# EAGLE design wordclock-2-r4 (EAGLE 5.12)
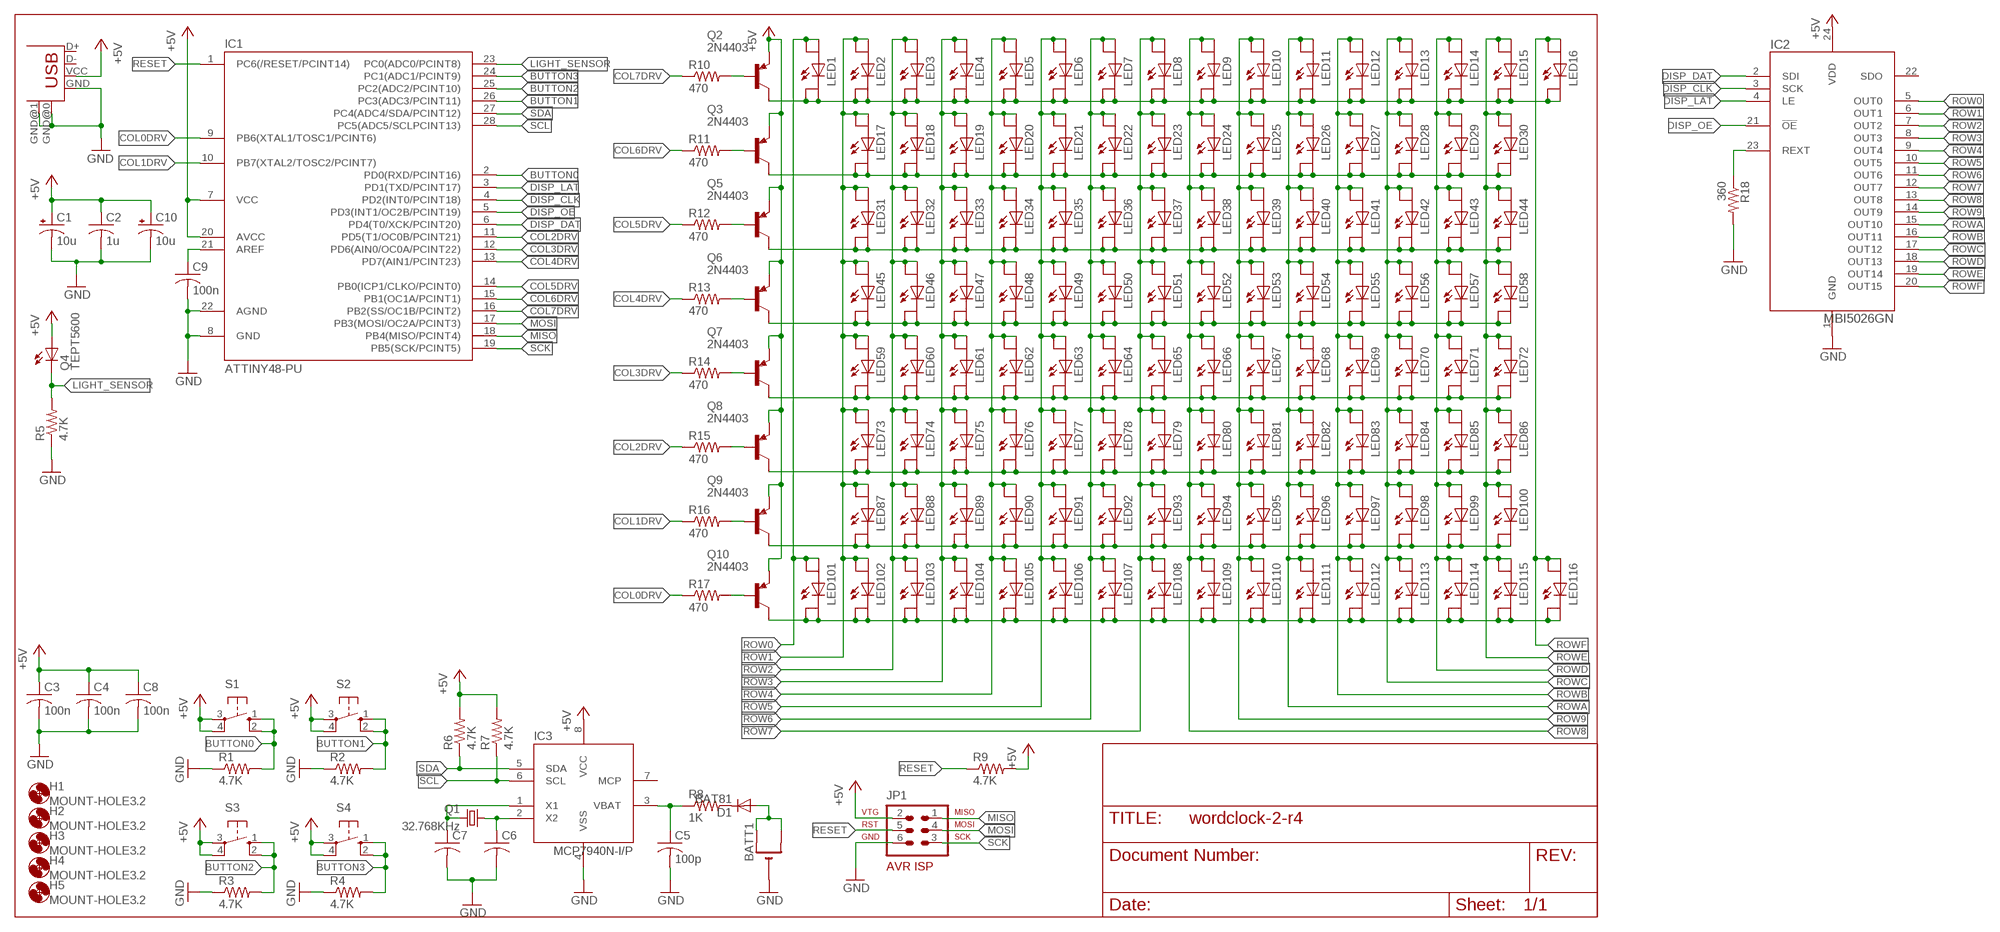
[diagram p0: schematic, sheet 1]

## Parts
BATT1  CR1220THM  [CR1220-THM]
C1  10u  CPOL-USE2-5  [E2-5]
C2  1u  C-US050-025X075  [C050-025X075]
C3  100n  C-US050-025X075  [C050-025X075]
C4  100n  C-US050-025X075  [C050-025X075]
C5  100p  C-US050-025X075  [C050-025X075]
C6  C-US025-025X050  [C025-025X050]
C7  C-US025-025X050  [C025-025X050]
C8  100n  C-US050-025X075  [C050-025X075]
C9  100n  C-US050-025X075  [C050-025X075]
C10  10u  CPOL-USE2-5  [E2-5]
D1  BAT81  [DO34-7]
H1  MOUNT-HOLE3.2  [3,2]
H2  MOUNT-HOLE3.2  [3,2]
H3  MOUNT-HOLE3.2  [3,2]
H4  MOUNT-HOLE3.2  [3,2]
H5  MOUNT-HOLE3.2  [3,2]
IC1  ATTINY48-PU  MEGA48/88/168-PU  [DIL28-3]
IC2  MBI5026GN  [DIP-24]
IC3  MCP7940N-I/P  [DIP-8]
JP1  AVR-ISP-6  [AVR-ISP-6]
LED1  LED-2PLCC2-T1.75  [PLCC2-T1.75]
LED2  LED-2PLCC2-T1.75  [PLCC2-T1.75]
LED3  LED-2PLCC2-T1.75  [PLCC2-T1.75]
LED4  LED-2PLCC2-T1.75  [PLCC2-T1.75]
LED5  LED-2PLCC2-T1.75  [PLCC2-T1.75]
LED6  LED-2PLCC2-T1.75  [PLCC2-T1.75]
LED7  LED-2PLCC2-T1.75  [PLCC2-T1.75]
LED8  LED-2PLCC2-T1.75  [PLCC2-T1.75]
LED9  LED-2PLCC2-T1.75  [PLCC2-T1.75]
LED10  LED-2PLCC2-T1.75  [PLCC2-T1.75]
LED11  LED-2PLCC2-T1.75  [PLCC2-T1.75]
LED12  LED-2PLCC2-T1.75  [PLCC2-T1.75]
LED13  LED-2PLCC2-T1.75  [PLCC2-T1.75]
LED14  LED-2PLCC2-T1.75  [PLCC2-T1.75]
LED15  LED-2PLCC2-T1.75  [PLCC2-T1.75]
LED16  LED-2PLCC2-T1.75  [PLCC2-T1.75]
LED17  LED-2PLCC2-T1.75  [PLCC2-T1.75]
LED18  LED-2PLCC2-T1.75  [PLCC2-T1.75]
LED19  LED-2PLCC2-T1.75  [PLCC2-T1.75]
LED20  LED-2PLCC2-T1.75  [PLCC2-T1.75]
LED21  LED-2PLCC2-T1.75  [PLCC2-T1.75]
LED22  LED-2PLCC2-T1.75  [PLCC2-T1.75]
LED23  LED-2PLCC2-T1.75  [PLCC2-T1.75]
LED24  LED-2PLCC2-T1.75  [PLCC2-T1.75]
LED25  LED-2PLCC2-T1.75  [PLCC2-T1.75]
LED26  LED-2PLCC2-T1.75  [PLCC2-T1.75]
LED27  LED-2PLCC2-T1.75  [PLCC2-T1.75]
LED28  LED-2PLCC2-T1.75  [PLCC2-T1.75]
LED29  LED-2PLCC2-T1.75  [PLCC2-T1.75]
LED30  LED-2PLCC2-T1.75  [PLCC2-T1.75]
LED31  LED-2PLCC2-T1.75  [PLCC2-T1.75]
LED32  LED-2PLCC2-T1.75  [PLCC2-T1.75]
LED33  LED-2PLCC2-T1.75  [PLCC2-T1.75]
LED34  LED-2PLCC2-T1.75  [PLCC2-T1.75]
LED35  LED-2PLCC2-T1.75  [PLCC2-T1.75]
LED36  LED-2PLCC2-T1.75  [PLCC2-T1.75]
LED37  LED-2PLCC2-T1.75  [PLCC2-T1.75]
LED38  LED-2PLCC2-T1.75  [PLCC2-T1.75]
LED39  LED-2PLCC2-T1.75  [PLCC2-T1.75]
LED40  LED-2PLCC2-T1.75  [PLCC2-T1.75]
LED41  LED-2PLCC2-T1.75  [PLCC2-T1.75]
LED42  LED-2PLCC2-T1.75  [PLCC2-T1.75]
LED43  LED-2PLCC2-T1.75  [PLCC2-T1.75]
LED44  LED-2PLCC2-T1.75  [PLCC2-T1.75]
LED45  LED-2PLCC2-T1.75  [PLCC2-T1.75]
LED46  LED-2PLCC2-T1.75  [PLCC2-T1.75]
LED47  LED-2PLCC2-T1.75  [PLCC2-T1.75]
LED48  LED-2PLCC2-T1.75  [PLCC2-T1.75]
LED49  LED-2PLCC2-T1.75  [PLCC2-T1.75]
LED50  LED-2PLCC2-T1.75  [PLCC2-T1.75]
LED51  LED-2PLCC2-T1.75  [PLCC2-T1.75]
LED52  LED-2PLCC2-T1.75  [PLCC2-T1.75]
LED53  LED-2PLCC2-T1.75  [PLCC2-T1.75]
LED54  LED-2PLCC2-T1.75  [PLCC2-T1.75]
LED55  LED-2PLCC2-T1.75  [PLCC2-T1.75]
LED56  LED-2PLCC2-T1.75  [PLCC2-T1.75]
LED57  LED-2PLCC2-T1.75  [PLCC2-T1.75]
LED58  LED-2PLCC2-T1.75  [PLCC2-T1.75]
LED59  LED-2PLCC2-T1.75  [PLCC2-T1.75]
LED60  LED-2PLCC2-T1.75  [PLCC2-T1.75]
LED61  LED-2PLCC2-T1.75  [PLCC2-T1.75]
LED62  LED-2PLCC2-T1.75  [PLCC2-T1.75]
LED63  LED-2PLCC2-T1.75  [PLCC2-T1.75]
LED64  LED-2PLCC2-T1.75  [PLCC2-T1.75]
LED65  LED-2PLCC2-T1.75  [PLCC2-T1.75]
LED66  LED-2PLCC2-T1.75  [PLCC2-T1.75]
LED67  LED-2PLCC2-T1.75  [PLCC2-T1.75]
LED68  LED-2PLCC2-T1.75  [PLCC2-T1.75]
LED69  LED-2PLCC2-T1.75  [PLCC2-T1.75]
LED70  LED-2PLCC2-T1.75  [PLCC2-T1.75]
LED71  LED-2PLCC2-T1.75  [PLCC2-T1.75]
LED72  LED-2PLCC2-T1.75  [PLCC2-T1.75]
LED73  LED-2PLCC2-T1.75  [PLCC2-T1.75]
LED74  LED-2PLCC2-T1.75  [PLCC2-T1.75]
LED75  LED-2PLCC2-T1.75  [PLCC2-T1.75]
LED76  LED-2PLCC2-T1.75  [PLCC2-T1.75]
LED77  LED-2PLCC2-T1.75  [PLCC2-T1.75]
LED78  LED-2PLCC2-T1.75  [PLCC2-T1.75]
LED79  LED-2PLCC2-T1.75  [PLCC2-T1.75]
LED80  LED-2PLCC2-T1.75  [PLCC2-T1.75]
LED81  LED-2PLCC2-T1.75  [PLCC2-T1.75]
LED82  LED-2PLCC2-T1.75  [PLCC2-T1.75]
LED83  LED-2PLCC2-T1.75  [PLCC2-T1.75]
LED84  LED-2PLCC2-T1.75  [PLCC2-T1.75]
LED85  LED-2PLCC2-T1.75  [PLCC2-T1.75]
LED86  LED-2PLCC2-T1.75  [PLCC2-T1.75]
LED87  LED-2PLCC2-T1.75  [PLCC2-T1.75]
LED88  LED-2PLCC2-T1.75  [PLCC2-T1.75]
LED89  LED-2PLCC2-T1.75  [PLCC2-T1.75]
LED90  LED-2PLCC2-T1.75  [PLCC2-T1.75]
LED91  LED-2PLCC2-T1.75  [PLCC2-T1.75]
LED92  LED-2PLCC2-T1.75  [PLCC2-T1.75]
LED93  LED-2PLCC2-T1.75  [PLCC2-T1.75]
LED94  LED-2PLCC2-T1.75  [PLCC2-T1.75]
LED95  LED-2PLCC2-T1.75  [PLCC2-T1.75]
LED96  LED-2PLCC2-T1.75  [PLCC2-T1.75]
LED97  LED-2PLCC2-T1.75  [PLCC2-T1.75]
LED98  LED-2PLCC2-T1.75  [PLCC2-T1.75]
LED99  LED-2PLCC2-T1.75  [PLCC2-T1.75]
LED100  LED-2PLCC2-T1.75  [PLCC2-T1.75]
LED101  LED-2PLCC2-T1.75  [PLCC2-T1.75]
LED102  LED-2PLCC2-T1.75  [PLCC2-T1.75]
LED103  LED-2PLCC2-T1.75  [PLCC2-T1.75]
LED104  LED-2PLCC2-T1.75  [PLCC2-T1.75]
LED105  LED-2PLCC2-T1.75  [PLCC2-T1.75]
LED106  LED-2PLCC2-T1.75  [PLCC2-T1.75]
LED107  LED-2PLCC2-T1.75  [PLCC2-T1.75]
LED108  LED-2PLCC2-T1.75  [PLCC2-T1.75]
LED109  LED-2PLCC2-T1.75  [PLCC2-T1.75]
LED110  LED-2PLCC2-T1.75  [PLCC2-T1.75]
LED111  LED-2PLCC2-T1.75  [PLCC2-T1.75]
LED112  LED-2PLCC2-T1.75  [PLCC2-T1.75]
LED113  LED-2PLCC2-T1.75  [PLCC2-T1.75]
LED114  LED-2PLCC2-T1.75  [PLCC2-T1.75]
LED115  LED-2PLCC2-T1.75  [PLCC2-T1.75]
LED116  LED-2PLCC2-T1.75  [PLCC2-T1.75]
Q1  32.768KHz  CRYSTALTC38H  [TC38H]
Q2  2N4403  2N3906  [TO92]
Q3  2N4403  2N3906  [TO92]
Q4  TEPT5600  LED5MM  [LED5MM]
Q5  2N4403  2N3906  [TO92]
Q6  2N4403  2N3906  [TO92]
Q7  2N4403  2N3906  [TO92]
Q8  2N4403  2N3906  [TO92]
Q9  2N4403  2N3906  [TO92]
Q10  2N4403  2N3906  [TO92]
R1  4.7K  R-US_0207/10  [0207/10]
R2  4.7K  R-US_0207/10  [0207/10]
R3  4.7K  R-US_0207/10  [0207/10]
R4  4.7K  R-US_0207/10  [0207/10]
R5  4.7K  R-US_0207/10  [0207/10]
R6  4.7K  R-US_0207/10  [0207/10]
R7  4.7K  R-US_0207/10  [0207/10]
R8  1K  R-US_0207/10  [0207/10]
R9  4.7K  R-US_0207/10  [0207/10]
R10  470  R-US_0207/10  [0207/10]
R11  470  R-US_0207/10  [0207/10]
R12  470  R-US_0207/10  [0207/10]
R13  470  R-US_0207/10  [0207/10]
R14  470  R-US_0207/10  [0207/10]
R15  470  R-US_0207/10  [0207/10]
R16  470  R-US_0207/10  [0207/10]
R17  470  R-US_0207/10  [0207/10]
R18  360  R-US_0207/10  [0207/10]
S1  10-XX  [B3F-10XX]
S2  10-XX  [B3F-10XX]
S3  10-XX  [B3F-10XX]
S4  10-XX  [B3F-10XX]
USB1  USB-U  [USB-MICROB-ALI]

## Nets
+5V: C1.+ C2.1 C3.1 C4.1 C8.1 C10.+ IC1.7(VCC) IC1.20(AVCC) IC2.24(VDD) IC3.8(VCC) JP1.2 Q2.3(E) Q3.3(E) Q4.A Q5.3(E) Q6.3(E) Q7.3(E) Q8.3(E) Q9.3(E) Q10.3(E) R6.2 R7.2 R9.2 S1.3(P) S1.4(P1) S2.3(P) S2.4(P1) S3.3(P) S3.4(P1) S4.3(P) S4.4(P1) USB1.VCC(VBUS)
BUTTON0: IC1.2(PD0(RXD/PCINT16)) R1.2 S1.1(S) S1.2(S1)
BUTTON1: IC1.26(PC3(ADC3/PCINT11)) R2.2 S2.1(S) S2.2(S1)
BUTTON2: IC1.25(PC2(ADC2/PCINT10)) R3.2 S3.1(S) S3.2(S1)
BUTTON3: IC1.24(PC1(ADC1/PCINT9)) R4.2 S4.1(S) S4.2(S1)
COL0: LED101.K1(K) LED101.K2(K1) LED102.K1(K) LED102.K2(K1) LED103.K1(K) LED103.K2(K1) LED104.K1(K) LED104.K2(K1) LED105.K1(K) LED105.K2(K1) LED106.K1(K) LED106.K2(K1) LED107.K1(K) LED107.K2(K1) LED108.K1(K) LED108.K2(K1) LED109.K1(K) LED109.K2(K1) LED110.K1(K) LED110.K2(K1) LED111.K1(K) LED111.K2(K1) LED112.K1(K) LED112.K2(K1) LED113.K1(K) LED113.K2(K1) LED114.K1(K) LED114.K2(K1) LED115.K1(K) LED115.K2(K1) LED116.K1(K) LED116.K2(K1) Q10.1(C)
COL0DRV: IC1.9(PB6(XTAL1/TOSC1/PCINT6)) R17.1
COL1: LED87.K1(K) LED87.K2(K1) LED88.K1(K) LED88.K2(K1) LED89.K1(K) LED89.K2(K1) LED90.K1(K) LED90.K2(K1) LED91.K1(K) LED91.K2(K1) LED92.K1(K) LED92.K2(K1) LED93.K1(K) LED93.K2(K1) LED94.K1(K) LED94.K2(K1) LED95.K1(K) LED95.K2(K1) LED96.K1(K) LED96.K2(K1) LED97.K1(K) LED97.K2(K1) LED98.K1(K) LED98.K2(K1) LED99.K1(K) LED99.K2(K1) LED100.K1(K) LED100.K2(K1) Q9.1(C)
COL1DRV: IC1.10(PB7(XTAL2/TOSC2/PCINT7)) R16.1
COL2: LED73.K1(K) LED73.K2(K1) LED74.K1(K) LED74.K2(K1) LED75.K1(K) LED75.K2(K1) LED76.K1(K) LED76.K2(K1) LED77.K1(K) LED77.K2(K1) LED78.K1(K) LED78.K2(K1) LED79.K1(K) LED79.K2(K1) LED80.K1(K) LED80.K2(K1) LED81.K1(K) LED81.K2(K1) LED82.K1(K) LED82.K2(K1) LED83.K1(K) LED83.K2(K1) LED84.K1(K) LED84.K2(K1) LED85.K1(K) LED85.K2(K1) LED86.K1(K) LED86.K2(K1) Q8.1(C)
COL2DRV: IC1.11(PD5(T1/OC0B/PCINT21)) R15.1
COL3: LED59.K1(K) LED59.K2(K1) LED60.K1(K) LED60.K2(K1) LED61.K1(K) LED61.K2(K1) LED62.K1(K) LED62.K2(K1) LED63.K1(K) LED63.K2(K1) LED64.K1(K) LED64.K2(K1) LED65.K1(K) LED65.K2(K1) LED66.K1(K) LED66.K2(K1) LED67.K1(K) LED67.K2(K1) LED68.K1(K) LED68.K2(K1) LED69.K1(K) LED69.K2(K1) LED70.K1(K) LED70.K2(K1) LED71.K1(K) LED71.K2(K1) LED72.K1(K) LED72.K2(K1) Q7.1(C)
COL3DRV: IC1.12(PD6(AIN0/OC0A/PCINT22)) R14.1
COL4: LED45.K1(K) LED45.K2(K1) LED46.K1(K) LED46.K2(K1) LED47.K1(K) LED47.K2(K1) LED48.K1(K) LED48.K2(K1) LED49.K1(K) LED49.K2(K1) LED50.K1(K) LED50.K2(K1) LED51.K1(K) LED51.K2(K1) LED52.K1(K) LED52.K2(K1) LED53.K1(K) LED53.K2(K1) LED54.K1(K) LED54.K2(K1) LED55.K1(K) LED55.K2(K1) LED56.K1(K) LED56.K2(K1) LED57.K1(K) LED57.K2(K1) LED58.K1(K) LED58.K2(K1) Q6.1(C)
COL4DRV: IC1.13(PD7(AIN1/PCINT23)) R13.1
COL5: LED31.K1(K) LED31.K2(K1) LED32.K1(K) LED32.K2(K1) LED33.K1(K) LED33.K2(K1) LED34.K1(K) LED34.K2(K1) LED35.K1(K) LED35.K2(K1) LED36.K1(K) LED36.K2(K1) LED37.K1(K) LED37.K2(K1) LED38.K1(K) LED38.K2(K1) LED39.K1(K) LED39.K2(K1) LED40.K1(K) LED40.K2(K1) LED41.K1(K) LED41.K2(K1) LED42.K1(K) LED42.K2(K1) LED43.K1(K) LED43.K2(K1) LED44.K1(K) LED44.K2(K1) Q5.1(C)
COL5DRV: IC1.14(PB0(ICP1/CLKO/PCINT0)) R12.1
COL6: LED17.K1(K) LED17.K2(K1) LED18.K1(K) LED18.K2(K1) LED19.K1(K) LED19.K2(K1) LED20.K1(K) LED20.K2(K1) LED21.K1(K) LED21.K2(K1) LED22.K1(K) LED22.K2(K1) LED23.K1(K) LED23.K2(K1) LED24.K1(K) LED24.K2(K1) LED25.K1(K) LED25.K2(K1) LED26.K1(K) LED26.K2(K1) LED27.K1(K) LED27.K2(K1) LED28.K1(K) LED28.K2(K1) LED29.K1(K) LED29.K2(K1) LED30.K1(K) LED30.K2(K1) Q3.1(C)
COL6DRV: IC1.15(PB1(OC1A/PCINT1)) R11.1
COL7: LED1.K1(K) LED1.K2(K1) LED2.K1(K) LED2.K2(K1) LED3.K1(K) LED3.K2(K1) LED4.K1(K) LED4.K2(K1) LED5.K1(K) LED5.K2(K1) LED6.K1(K) LED6.K2(K1) LED7.K1(K) LED7.K2(K1) LED8.K1(K) LED8.K2(K1) LED9.K1(K) LED9.K2(K1) LED10.K1(K) LED10.K2(K1) LED11.K1(K) LED11.K2(K1) LED12.K1(K) LED12.K2(K1) LED13.K1(K) LED13.K2(K1) LED14.K1(K) LED14.K2(K1) LED15.K1(K) LED15.K2(K1) LED16.K1(K) LED16.K2(K1) Q2.1(C)
COL7DRV: IC1.16(PB2(SS/OC1B/PCINT2)) R10.1
DISP_CLK: IC1.4(PD2(INT0/PCINT18)) IC2.3(SCK)
DISP_DAT: IC1.6(PD4(T0/XCK/PCINT20)) IC2.2(SDI)
DISP_LAT: IC1.3(PD1(TXD/PCINT17)) IC2.4(LE)
DISP_OE: IC1.5(PD3(INT1/OC2B/PCINT19)) IC2.21(!OE)
GND: BATT1.- C1.- C2.2 C3.2 C4.2 C5.2 C6.2 C7.2 C8.2 C9.2 C10.- IC1.8(GND) IC1.22(AGND) IC2.1(GND) IC3.4(VSS) JP1.6 R1.1 R2.1 R3.1 R4.1 R5.1 R18.2 USB1.GND USB1.GND@0(GND) USB1.GND@1(GND)
LIGHT_SENSOR: IC1.23(PC0(ADC0/PCINT8)) Q4.K(C) R5.2
MISO: IC1.18(PB4(MISO/PCINT4)) JP1.1
MOSI: IC1.17(PB3(MOSI/OC2A/PCINT3)) JP1.4
N$1: C7.1 IC3.1(X1) Q1.2
N$2: C6.1 IC3.2(X2) Q1.1
N$3: D1.C R8.2
N$4: BATT1.+1(+) BATT1.+2(+1) D1.A
N$5: Q2.2(B) R10.2
N$6: C5.1 IC3.3(VBAT) R8.1
N$7: Q3.2(B) R11.2
N$8: Q5.2(B) R12.2
N$9: Q6.2(B) R13.2
N$10: Q7.2(B) R14.2
N$11: Q8.2(B) R15.2
N$12: Q9.2(B) R16.2
N$13: Q10.2(B) R17.2
N$14: C9.1 IC1.21(AREF)
N$15: IC2.23(REXT) R18.1
RESET: IC1.1(PC6(/RESET/PCINT14)) JP1.5 R9.1
ROW0: IC2.5(OUT0) LED1.A1(A) LED1.A2(A1) LED101.A1(A) LED101.A2(A1)
ROW1: IC2.6(OUT1) LED2.A1(A) LED2.A2(A1) LED17.A1(A) LED17.A2(A1) LED31.A1(A) LED31.A2(A1) LED45.A1(A) LED45.A2(A1) LED59.A1(A) LED59.A2(A1) LED73.A1(A) LED73.A2(A1) LED87.A1(A) LED87.A2(A1) LED102.A1(A) LED102.A2(A1)
ROW2: IC2.7(OUT2) LED3.A1(A) LED3.A2(A1) LED18.A1(A) LED18.A2(A1) LED32.A1(A) LED32.A2(A1) LED46.A1(A) LED46.A2(A1) LED60.A1(A) LED60.A2(A1) LED74.A1(A) LED74.A2(A1) LED88.A1(A) LED88.A2(A1) LED103.A1(A) LED103.A2(A1)
ROW3: IC2.8(OUT3) LED4.A1(A) LED4.A2(A1) LED19.A1(A) LED19.A2(A1) LED33.A1(A) LED33.A2(A1) LED47.A1(A) LED47.A2(A1) LED61.A1(A) LED61.A2(A1) LED75.A1(A) LED75.A2(A1) LED89.A1(A) LED89.A2(A1) LED104.A1(A) LED104.A2(A1)
ROW4: IC2.9(OUT4) LED5.A1(A) LED5.A2(A1) LED20.A1(A) LED20.A2(A1) LED34.A1(A) LED34.A2(A1) LED48.A1(A) LED48.A2(A1) LED62.A1(A) LED62.A2(A1) LED76.A1(A) LED76.A2(A1) LED90.A1(A) LED90.A2(A1) LED105.A1(A) LED105.A2(A1)
ROW5: IC2.10(OUT5) LED6.A1(A) LED6.A2(A1) LED21.A1(A) LED21.A2(A1) LED35.A1(A) LED35.A2(A1) LED49.A1(A) LED49.A2(A1) LED63.A1(A) LED63.A2(A1) LED77.A1(A) LED77.A2(A1) LED91.A1(A) LED91.A2(A1) LED106.A1(A) LED106.A2(A1)
ROW6: IC2.11(OUT6) LED7.A1(A) LED7.A2(A1) LED22.A1(A) LED22.A2(A1) LED36.A1(A) LED36.A2(A1) LED50.A1(A) LED50.A2(A1) LED64.A1(A) LED64.A2(A1) LED78.A1(A) LED78.A2(A1) LED92.A1(A) LED92.A2(A1) LED107.A1(A) LED107.A2(A1)
ROW7: IC2.12(OUT7) LED8.A1(A) LED8.A2(A1) LED23.A1(A) LED23.A2(A1) LED37.A1(A) LED37.A2(A1) LED51.A1(A) LED51.A2(A1) LED65.A1(A) LED65.A2(A1) LED79.A1(A) LED79.A2(A1) LED93.A1(A) LED93.A2(A1) LED108.A1(A) LED108.A2(A1)
ROW8: IC2.13(OUT8) LED9.A1(A) LED9.A2(A1) LED24.A1(A) LED24.A2(A1) LED38.A1(A) LED38.A2(A1) LED52.A1(A) LED52.A2(A1) LED66.A1(A) LED66.A2(A1) LED80.A1(A) LED80.A2(A1) LED94.A1(A) LED94.A2(A1) LED109.A1(A) LED109.A2(A1)
ROW9: IC2.14(OUT9) LED10.A1(A) LED10.A2(A1) LED25.A1(A) LED25.A2(A1) LED39.A1(A) LED39.A2(A1) LED53.A1(A) LED53.A2(A1) LED67.A1(A) LED67.A2(A1) LED81.A1(A) LED81.A2(A1) LED95.A1(A) LED95.A2(A1) LED110.A1(A) LED110.A2(A1)
ROWA: IC2.15(OUT10) LED11.A1(A) LED11.A2(A1) LED26.A1(A) LED26.A2(A1) LED40.A1(A) LED40.A2(A1) LED54.A1(A) LED54.A2(A1) LED68.A1(A) LED68.A2(A1) LED82.A1(A) LED82.A2(A1) LED96.A1(A) LED96.A2(A1) LED111.A1(A) LED111.A2(A1)
ROWB: IC2.16(OUT11) LED12.A1(A) LED12.A2(A1) LED27.A1(A) LED27.A2(A1) LED41.A1(A) LED41.A2(A1) LED55.A1(A) LED55.A2(A1) LED69.A1(A) LED69.A2(A1) LED83.A1(A) LED83.A2(A1) LED97.A1(A) LED97.A2(A1) LED112.A1(A) LED112.A2(A1)
ROWC: IC2.17(OUT12) LED13.A1(A) LED13.A2(A1) LED28.A1(A) LED28.A2(A1) LED42.A1(A) LED42.A2(A1) LED56.A1(A) LED56.A2(A1) LED70.A1(A) LED70.A2(A1) LED84.A1(A) LED84.A2(A1) LED98.A1(A) LED98.A2(A1) LED113.A1(A) LED113.A2(A1)
ROWD: IC2.18(OUT13) LED14.A1(A) LED14.A2(A1) LED29.A1(A) LED29.A2(A1) LED43.A1(A) LED43.A2(A1) LED57.A1(A) LED57.A2(A1) LED71.A1(A) LED71.A2(A1) LED85.A1(A) LED85.A2(A1) LED99.A1(A) LED99.A2(A1) LED114.A1(A) LED114.A2(A1)
ROWE: IC2.19(OUT14) LED15.A1(A) LED15.A2(A1) LED30.A1(A) LED30.A2(A1) LED44.A1(A) LED44.A2(A1) LED58.A1(A) LED58.A2(A1) LED72.A1(A) LED72.A2(A1) LED86.A1(A) LED86.A2(A1) LED100.A1(A) LED100.A2(A1) LED115.A1(A) LED115.A2(A1)
ROWF: IC2.20(OUT15) LED16.A1(A) LED16.A2(A1) LED116.A1(A) LED116.A2(A1)
SCK: IC1.19(PB5(SCK/PCINT5)) JP1.3
SCL: IC1.28(PC5(ADC5/SCLPCINT13)) IC3.6(SCL) R7.1
SDA: IC1.27(PC4(ADC4/SDA/PCINT12)) IC3.5(SDA) R6.1
Unconnected: IC2.22(SDO) IC3.7(MCP) USB1.D+ USB1.D-

## Library data of the parts
BATT1 = adafruit:CR1220: CR1216/CR1220/CR1225 12mm 3V lithium coin cell Great for battery packup. Both SMT and THM holders. Note the THM package has the ground pads on both sides of the PCB so that the masks are the same - this reduces the cost
C1 C10 = rcl:CPOL-US: POLARIZED CAPACITOR, American symbol
C2-C9 = rcl:C-US: CAPACITOR, American symbol
D1 = diode:BAT81: DIODE barrier diode
H1-H5 = holes:MOUNT-HOLE: MOUNTING HOLE with drill center marker
IC1 = avr-5-4.16:MEGA48/88/168-PU
IC2 = rbg-macroblock-led-driver:MBI5026
IC3 = rbg-microchip-rtc:MCP7940N
JP1 = avr-5:AVR-ISP-6: AVR ISP-6 Serial Programming Header
LED1-LED116 = rbg-comboled:LED-2
Q1 = crystal:CRYSTAL: CRYSTAL; OC_FARNELL: unknown; OC_NEWARK: unknown
Q2 Q3 Q5-Q10 = transistor-pnp:2N3906: PNP Transistor
Q4 = led:LED: LED OSRAM: - CHIPLED LG R971, LG N971, LY N971, LG Q971, LY Q971, LO R971, LY R971 LH N974, LH R974 LS Q976, LO Q976, LY Q976 LO Q996 - Hyper CHIPLED LW Q18S LB Q993, LB Q99A, LB R99A - SideLED LS A670, LO A670, LY A670, LG A670, LP A670 LB A673, LV A673, LT A673, LW A673 LH A674 LY A675 LS A676, LA A676, LO A676, LY A676, LW A676 LS A679, LY A679, LG A679 - Hyper Micro SIDELED® LS Y876, LA Y876, LO Y876, LY Y876 LT Y87S - SmartLED LW L88C, LW L88S LB L89C, LB L89S, LG L890 LS L89K, LO L89K, LY L89K LS L896, LA L896, LO L896, LY L896 - TOPLED LS T670, LO T670, LY T670, LG T670, LP T670 LSG T670, LSP T670, LSY T670, LOP T670, LYG T670 LG T671, LOG T671, LSG T671 LB T673, LV T673, LT T673, LW T673 LH T674 LS T676, LA T676, LO T676, LY T676, LB T676, LH T676, LSB T676, LW T676 LB T67C, LV T67C, LT T67C, LS T67K, LO T67K, LY T67K, LW E67C LS E67B, LA E67B, LO E67B, LY E67B, LB E67C, LV E67C, LT E67C LW T67C LS T679, LY T679, LG T679 LS T770, LO T770, LY T770, LG T770, LP T770 LB T773, LV T773, LT T773, LW T773 LH T774 LS E675, LA E675, LY E675, LS T675 LS T776, LA T776, LO T776, LY T776, LB T776 LHGB T686 LT T68C, LB T68C - Hyper Mini TOPLED® LB M676 - Mini TOPLED Santana® LG M470 LS M47K, LO M47K, LY M47K Source: http://www.osram.convergy.de LUXEON: - LUMILED® LXK2-PW12-R00, LXK2-PW12-S00, LXK2-PW14-U00, LXK2-PW14-V00 LXK2-PM12-R00, LXK2-PM12-S00, LXK2-PM14-U00 LXK2-PE12-Q00, LXK2-PE12-R00, LXK2-PE12-S00, LXK2-PE14-T00, LXK2-PE14-U00 LXK2-PB12-K00, LXK2-PB12-L00, LXK2-PB12-M00, LXK2-PB14-N00, LXK2-PB14-P00, LXK2-PB14-Q00 LXK2-PR12-L00, LXK2-PR12-M00, LXK2-PR14-Q00, LXK2-PR14-R00 LXK2-PD12-Q00, LXK2-PD12-R00, LXK2-PD12-S00 LXK2-PH12-R00, LXK2-PH12-S00 LXK2-PL12-P00, LXK2-PL12-Q00, LXK2-PL12-R00 Source: www.luxeon.com KINGBRIGHT: KA-3528ASYC Source: www.kingbright.com
R1-R18 = rcl:R-US_: RESISTOR, American symbol
S1-S4 = switch-omron:10-XX: OMRON SWITCH; MPN: B3F-1000; OC_FARNELL: 176432; OC_NEWARK: 36M3542
USB1 = con-usb-2:USB: USB Connectors

## Board
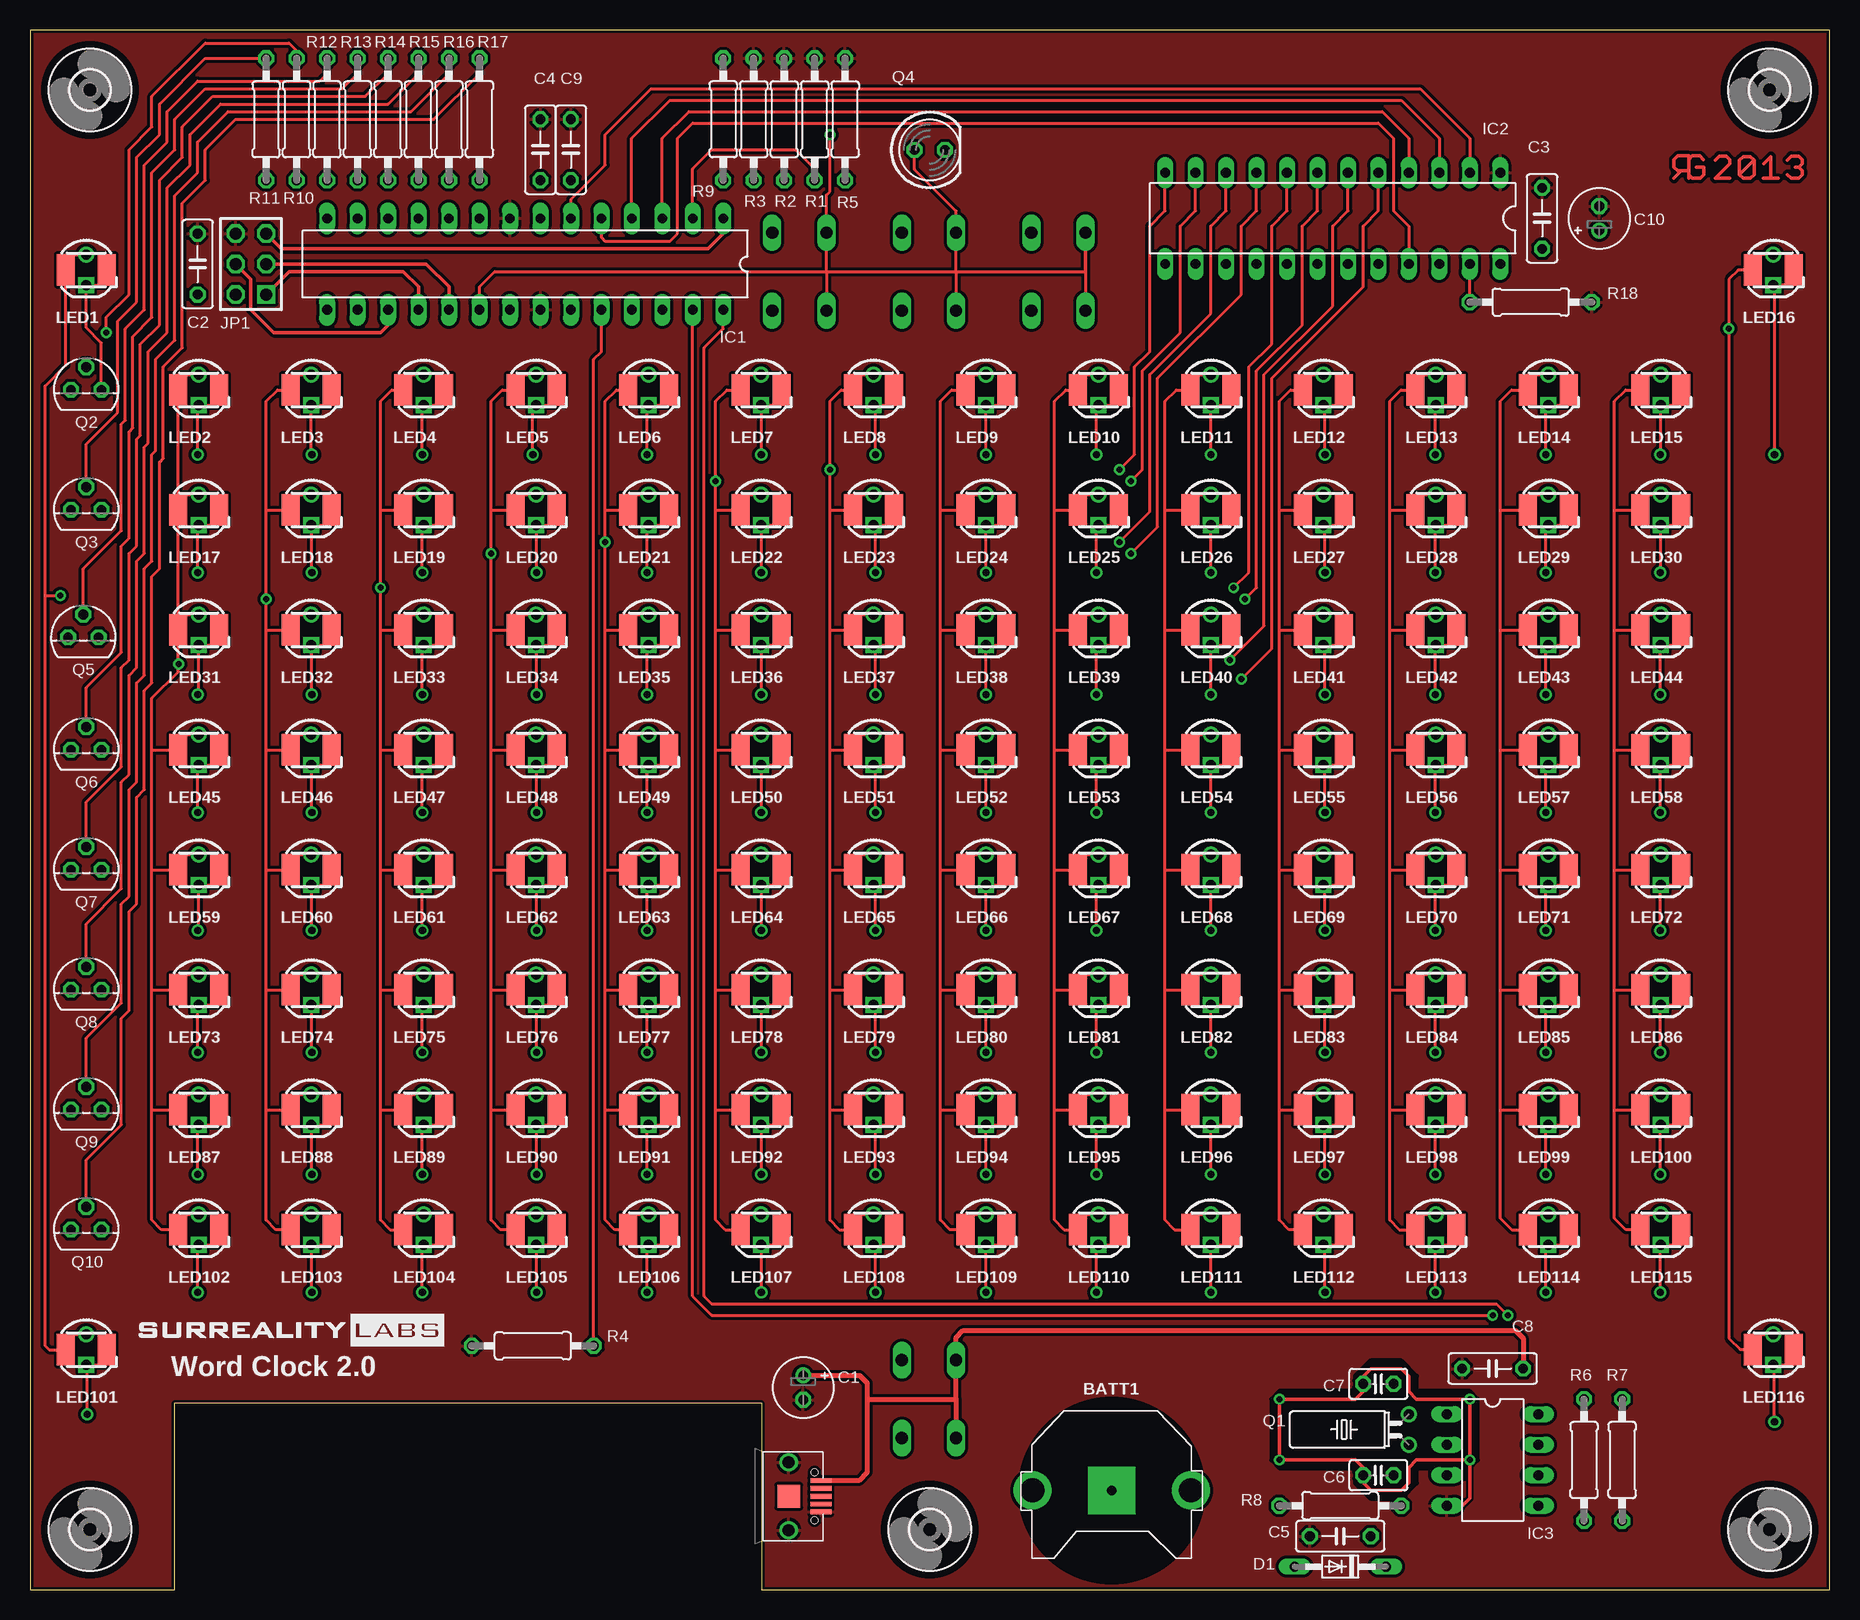
[diagram p1: board, top side]
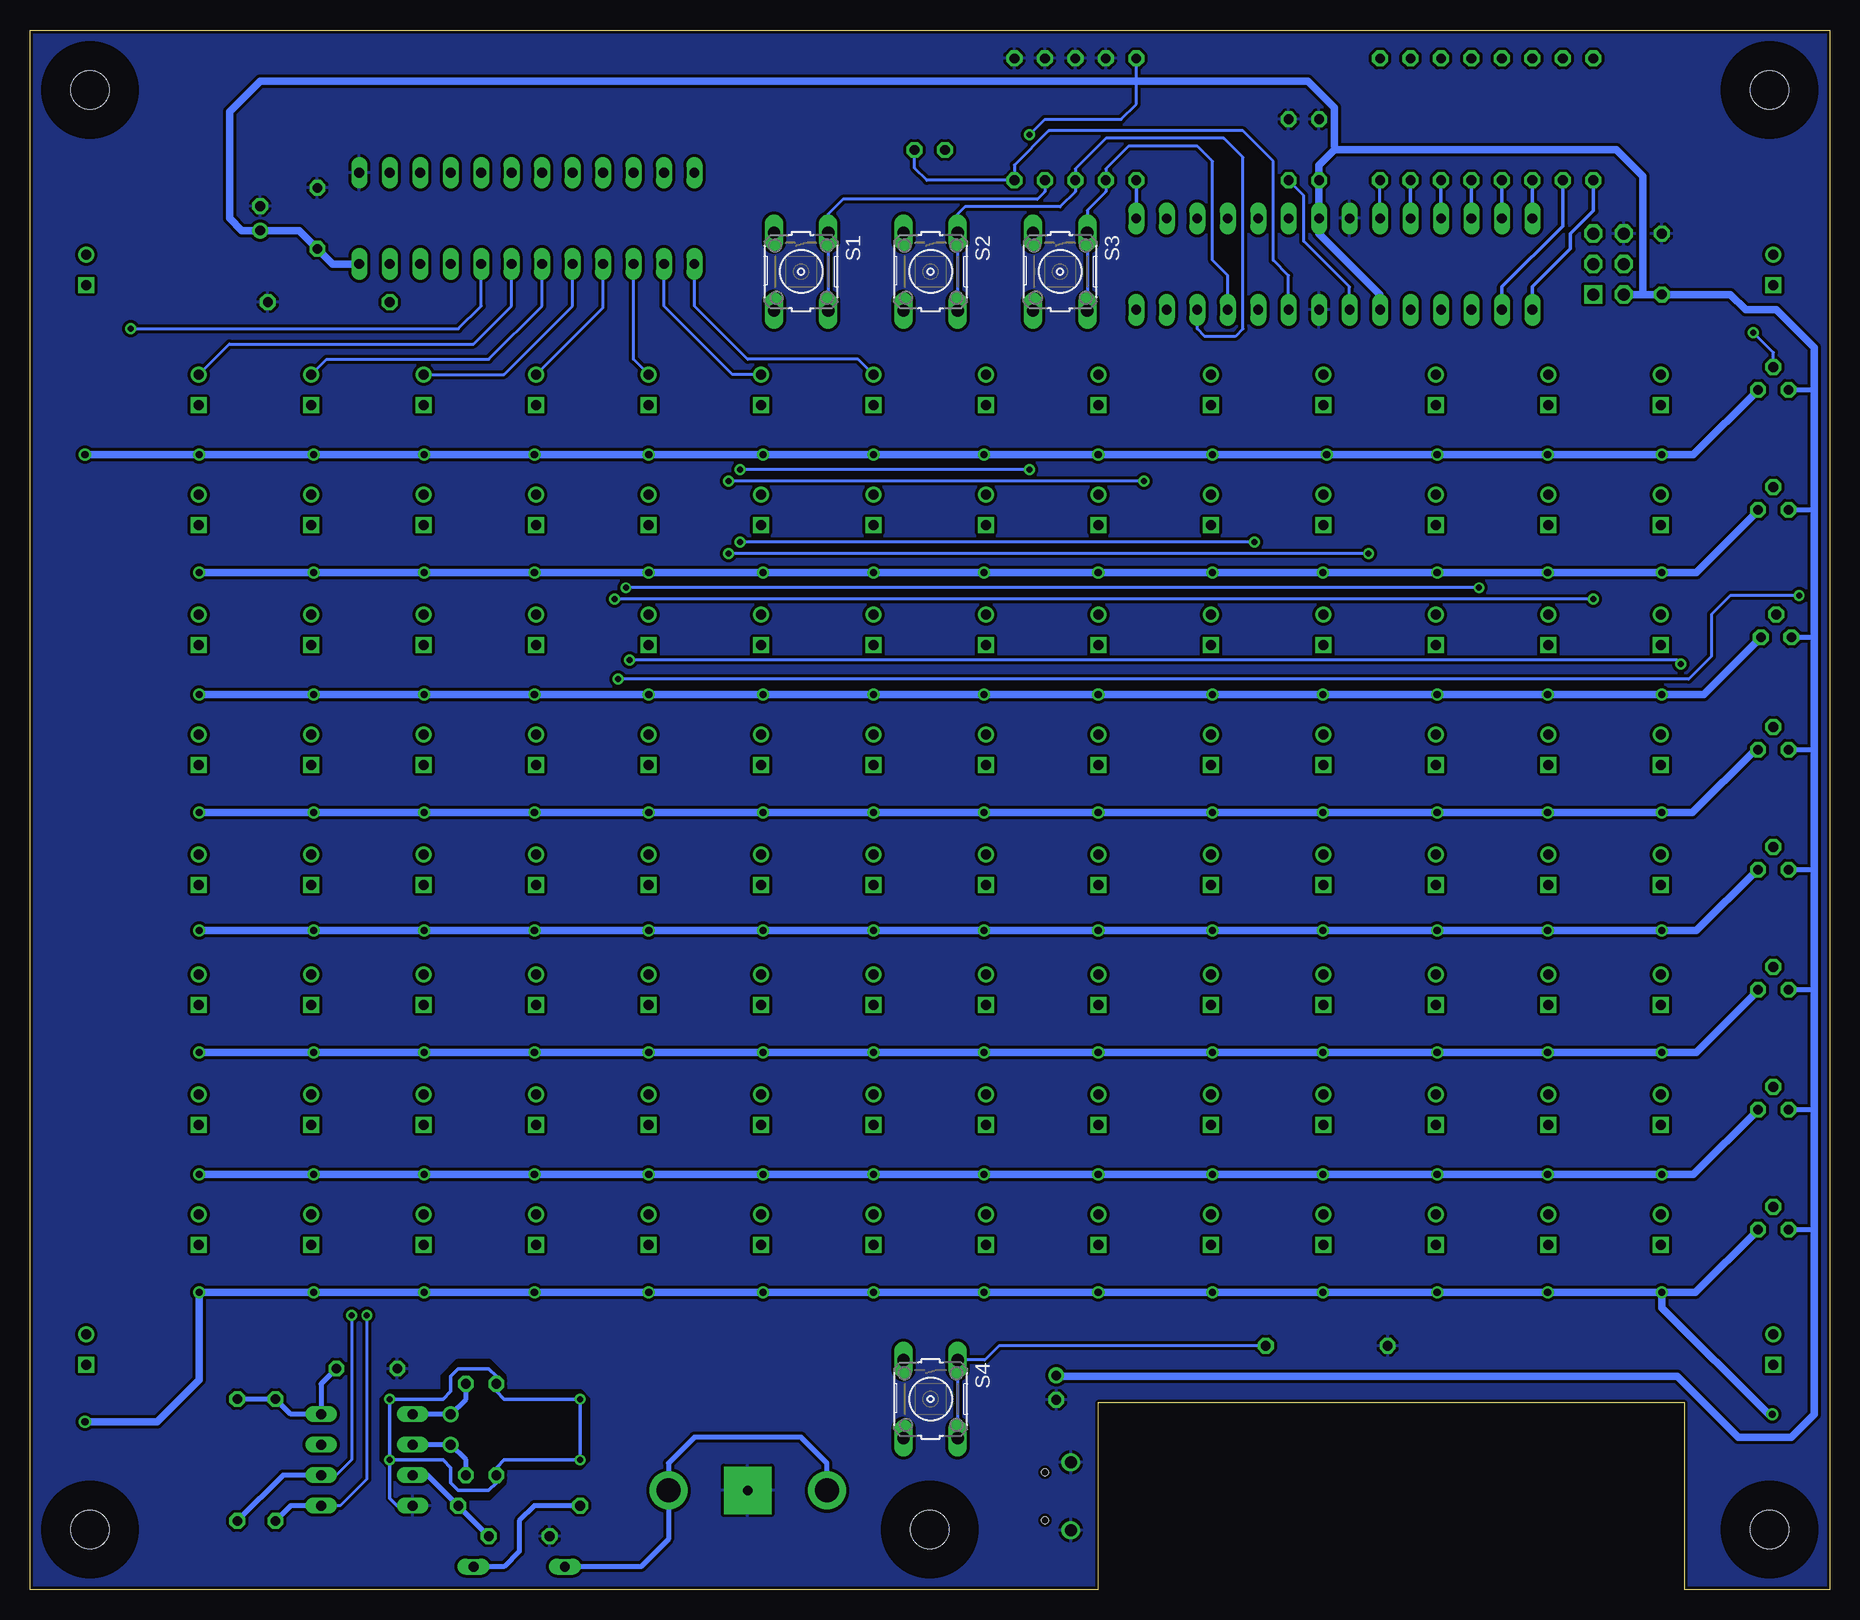
[diagram p2: board, bottom side, seen from below]

Size 150 x 130 mm. Coordinates in mm from the lower left corner, seen from the top.
Outline: 0,0 12.06,0 12.06,15.56 60.96,15.56 60.96,0 150,0 150,130 0,130 0,0
Copper layers (1*16): Top 0.035mm / dielectric 1.5mm / Bottom 0.035mm
Design rules "default *": minimum track width 10mil, minimum drill 19mil, track to track 10mil, track to pad 10mil, pad to pad 10mil, via to via 10mil, smd to smd 10mil, copper to edge 10mil, drill to drill 8mil, minimum pad ring 10mil, minimum via ring 8mil, stop-mask expansion 4mil, vias tented up to drill 20mil, thermal gap 10mil
tRestrict: area 103.5,7.6 to 120.7,19.1; area 87.6,5.7 to 92.7,10.8; area 82.5,0.6 to 97.8,15.9; 2 lines
bRestrict: area 103.5,7.6 to 120.7,19.1; 2 lines

### Footprints (pad centres in the part's own frame; a part is rotated, then mirrored left to right if it is on the bottom)
CR1220-THM = drill 2 pad 3.175 round: +1 -6.604,0; +2 6.604,0 | drill 0.8 pad 3.962 square: - 0,0
E2-5 = drill 0.813 pad 1.27 round: + -1.016,0 | drill 0.813 pad 1.27 octagon: - 1.016,0
C050-025X075 = drill 0.813 octagon: 1 -2.54,0; 2 2.54,0
C025-025X050 = drill 0.813 octagon: 1 -1.27,0; 2 1.27,0
DO34-7 = drill 0.813 long: A 3.81,0; C -3.81,0
3,2 = hole 3.2: 0,0
DIL28-3 = drill 0.813 long: 1 -16.51,-3.81; 2 -13.97,-3.81; 3 -11.43,-3.81; 4 -8.89,-3.81; 5 -6.35,-3.81; 6 -3.81,-3.81; 7 -1.27,-3.81; 8 1.27,-3.81; 9 3.81,-3.81; 10 6.35,-3.81; 11 8.89,-3.81; 12 11.43,-3.81; 13 13.97,-3.81; 14 16.51,-3.81; 15 16.51,3.81; 16 13.97,3.81; 17 11.43,3.81; 18 8.89,3.81; 19 6.35,3.81; 20 3.81,3.81; 21 1.27,3.81; 22 -1.27,3.81; 23 -3.81,3.81; 24 -6.35,3.81; 25 -8.89,3.81; 26 -11.43,3.81; 27 -13.97,3.81; 28 -16.51,3.81
DIP-24 = drill 0.813 long: 1 -13.97,-3.81; 2 -11.43,-3.81; 3 -8.89,-3.81; 4 -6.35,-3.81; 5 -3.81,-3.81; 6 -1.27,-3.81; 7 1.27,-3.81; 8 3.81,-3.81; 9 6.35,-3.81; 10 8.89,-3.81; 11 11.43,-3.81; 12 13.97,-3.81; 13 13.97,3.81; 14 11.43,3.81; 15 8.89,3.81; 16 6.35,3.81; 17 3.81,3.81; 18 1.27,3.81; 19 -1.27,3.81; 20 -3.81,3.81; 21 -6.35,3.81; 22 -8.89,3.81; 23 -11.43,3.81; 24 -13.97,3.81
DIP-8 = drill 0.813 long: 1 -3.81,-3.81; 2 -1.27,-3.81; 3 1.27,-3.81; 4 3.81,-3.81; 5 3.81,3.81; 6 1.27,3.81; 7 -1.27,3.81; 8 -3.81,3.81
AVR-ISP-6 = drill 1.016 square: 1 -2.54,-1.27 | drill 1.016 octagon: 2 -2.54,1.27; 3 0,-1.27; 4 0,1.27; 5 2.54,-1.27; 6 2.54,1.27
PLCC2-T1.75 = drill 0.8 round: A1 0,1.27 | smd 1.5 x 2.6: A2 -1.7,0; K2 1.7,0 | drill 0.8 square: K1 0,-1.27
TC38H = drill 0.813 round: 1 -1.27,0; 2 1.27,0
TO92 = drill 0.813 octagon: 1 1.27,0; 2 0,1.905; 3 -1.27,0
LED5MM = drill 0.813 octagon: A -1.27,0; K 1.27,0
0207/10 = drill 0.813 octagon: 1 -5.08,0; 2 5.08,0
B3F-10XX = drill 1.016 long: 1 -3.251,2.261; 2 3.251,2.261; 3 -3.251,-2.261; 4 3.251,-2.261
USB-MICROB-ALI = smd 0.4 x 1.75: D+ 0,2.675; D- -0.65,2.675; GND 1.3,2.675; ID 0.65,2.675; VCC -1.3,2.675 | drill 1 round: GND@0 -2.825,0; GND@1 2.825,0 | smd 1.9 x 1.9: GND@2 0,0 | hole 0.55: -2,2.15; 2,2.15

### Placement (x,y rotation side)
BATT1  90.17,8.26 180 top
C1  64.45,16.83 270 top
C2  13.97,110.49 90 top
C3  126.05,114.3 90 top
C4  42.55,120.02 90 top
C5  109.22,4.45 180 top
C6  112.39,9.53 180 top
C7  112.39,17.14 180 top
C8  121.92,18.41 180 top
C9  45.09,120.02 90 top
C10  130.81,114.3 90 top
D1  109.22,1.91 180 top
H1  5,125 0 top
H2  145,125 0 top
H3  145,5 0 top
H4  5,5 0 top
H5  75,5 0 top
IC1  41.27,110.49 180 top
IC2  108.58,114.3 180 top
IC3  121.92,10.79 270 top
JP1  18.41,110.49 90 top
LED1  4.69,110 0 top
LED2  14.06,100 0 top
LED3  23.44,100 0 top
LED4  32.81,100 0 top
LED5  42.19,100 0 top
LED6  51.56,100 0 top
LED7  60.94,100 0 top
LED8  70.31,100 0 top
LED9  79.69,100 0 top
LED10  89.06,100 0 top
LED11  98.44,100 0 top
LED12  107.81,100 0 top
LED13  117.19,100 0 top
LED14  126.56,100 0 top
LED15  135.94,100 0 top
LED16  145.31,110 0 top
LED17  14.06,90 0 top
LED18  23.44,90 0 top
LED19  32.81,90 0 top
LED20  42.19,90 0 top
LED21  51.56,90 0 top
LED22  60.94,90 0 top
LED23  70.31,90 0 top
LED24  79.69,90 0 top
LED25  89.06,90 0 top
LED26  98.44,90 0 top
LED27  107.81,90 0 top
LED28  117.19,90 0 top
LED29  126.56,90 0 top
LED30  135.94,90 0 top
LED31  14.06,80 0 top
LED32  23.44,80 0 top
LED33  32.81,80 0 top
LED34  42.19,80 0 top
LED35  51.56,80 0 top
LED36  60.94,80 0 top
LED37  70.31,80 0 top
LED38  79.69,80 0 top
LED39  89.06,80 0 top
LED40  98.44,80 0 top
LED41  107.81,80 0 top
LED42  117.19,80 0 top
LED43  126.56,80 0 top
LED44  135.94,80 0 top
LED45  14.06,70 0 top
LED46  23.44,70 0 top
LED47  32.81,70 0 top
LED48  42.19,70 0 top
LED49  51.56,70 0 top
LED50  60.94,70 0 top
LED51  70.31,70 0 top
LED52  79.69,70 0 top
LED53  89.06,70 0 top
LED54  98.44,70 0 top
LED55  107.81,70 0 top
LED56  117.19,70 0 top
LED57  126.56,70 0 top
LED58  135.94,70 0 top
LED59  14.06,60 0 top
LED60  23.44,60 0 top
LED61  32.81,60 0 top
LED62  42.19,60 0 top
LED63  51.56,60 0 top
LED64  60.94,60 0 top
LED65  70.31,60 0 top
LED66  79.69,60 0 top
LED67  89.06,60 0 top
LED68  98.44,60 0 top
LED69  107.81,60 0 top
LED70  117.19,60 0 top
LED71  126.56,60 0 top
LED72  135.94,60 0 top
LED73  14.06,50 0 top
LED74  23.44,50 0 top
LED75  32.81,50 0 top
LED76  42.19,50 0 top
LED77  51.56,50 0 top
LED78  60.94,50 0 top
LED79  70.31,50 0 top
LED80  79.69,50 0 top
LED81  89.06,50 0 top
LED82  98.44,50 0 top
LED83  107.81,50 0 top
LED84  117.19,50 0 top
LED85  126.56,50 0 top
LED86  135.94,50 0 top
LED87  14.06,40 0 top
LED88  23.44,40 0 top
LED89  32.81,40 0 top
LED90  42.19,40 0 top
LED91  51.56,40 0 top
LED92  60.94,40 0 top
LED93  70.31,40 0 top
LED94  79.69,40 0 top
LED95  89.06,40 0 top
LED96  98.44,40 0 top
LED97  107.81,40 0 top
LED98  117.19,40 0 top
LED99  126.56,40 0 top
LED100  135.94,40 0 top
LED101  4.69,20 0 top
LED102  14.06,30 0 top
LED103  23.44,30 0 top
LED104  32.81,30 0 top
LED105  42.19,30 0 top
LED106  51.56,30 0 top
LED107  60.94,30 0 top
LED108  70.31,30 0 top
LED109  79.69,30 0 top
LED110  89.06,30 0 top
LED111  98.44,30 0 top
LED112  107.81,30 0 top
LED113  117.19,30 0 top
LED114  126.56,30 0 top
LED115  135.94,30 0 top
LED116  145.31,20 0 top
Q1  114.94,13.34 90 top
Q2  4.69,100 0 top
Q3  4.69,90 0 top
Q4  75,120 0 top
Q5  4.45,79.38 0 top
Q6  4.69,70 0 top
Q7  4.69,60 0 top
Q8  4.69,50 0 top
Q9  4.69,40 0 top
Q10  4.69,30 0 top
R1  65.41,122.56 270 top
R2  62.87,122.56 270 top
R3  60.33,122.56 270 top
R4  41.91,20.32 0 top
R5  67.94,122.56 270 top
R6  129.54,10.79 90 top
R7  132.72,10.79 90 top
R8  109.22,6.99 180 top
R9  57.78,122.56 90 top
R10  22.23,122.56 90 top
R11  19.68,122.56 90 top
R12  24.77,122.56 90 top
R13  27.3,122.56 90 top
R14  29.84,122.56 90 top
R15  32.38,122.56 90 top
R16  34.92,122.56 90 top
R17  37.47,122.56 90 top
R18  125.09,107.31 0 top
S1  85.72,109.86 270 bottom
S2  74.93,109.86 270 bottom
S3  64.14,109.86 270 bottom
S4  74.93,15.88 270 bottom
U$2  [RGLOGO_SMALL_2013]  138.43,117.47 0 top
U$3  [SURREALITY_LOGO_SILK]  8.89,20.32 0 top
USB1  63.25,7.78 270 top

### Tracks (layer width: path | path; a pad name or v marks a point on that pad's centre or on a via)
+5V  (via drill 0.5)
  Top 0.254: 77.19,109.86 S2.4 | 77.19,109.86 S2.3 77.19,114.9 73.73,118.36 Q4.A | S1.4 S1.3 87.99,109.89 87.95,109.86 77.19,109.86 | 66.4,109.86 S3.4 | v66.67,121.28 66.67,116.52 66.4,116.24 S3.3 66.4,109.86 | IC1.20 37.47,108.58 38.73,109.86 66.4,109.86 | 66.4,109.86 77.19,109.86 | 69.79,15.94 69.85,15.88
  Top 0.406: USB1.VCC 69.09,9.08 69.79,9.78 69.79,15.94 69.79,17.21 69.15,17.84 C1.+ | 77.19,15.88 S4.4 | 77.19,15.88 S4.3 77.19,20.99 77.79,21.59 123.83,21.59 124.46,20.95 C8.1 | 69.85,15.88 77.19,15.88
  Bottom 0.254: v66.67,121.28 65.41,122.56 59.05,122.56 57.78,123.83 R9.2
  Bottom 0.406: C8.1 125.73,17.14 IC3.8 128.27,14.61 R6.2 R7.2 | Q10.3 1.43,30 1.27,29.84 | Q9.3 1.27,40 1.27,40.01 | Q8.3 1.44,50 1.27,50.16 | Q6.3 1.42,70 1.27,69.85 | 1.27,79.38 Q5.3 | Q7.3 1.28,60 1.27,60.01 | Q3.3 1.28,90 1.27,90.01 | Q2.3 1.42,100 1.27,99.85 | 41.27,120.33 40.96,120.02
  Bottom 0.61: 15.56,107.95 C2.1 8.26,107.95 6.99,106.68 4.45,106.68 1.27,103.5 1.27,99.85 1.27,90.01 1.27,79.38 1.27,69.85 1.27,60.01 1.27,50.16 1.27,40.01 1.27,29.84 1.27,14.61 3.17,12.7 7.62,12.7 12.7,17.78 64.39,17.78 C1.+ | 15.56,107.95 JP1.2 | 15.56,107.95 15.56,117.79 17.78,120.02 40.96,120.02 41.27,120.02 42.55,118.75 C4.1 IC1.7 42.55,113.03 37.47,107.95 IC1.20 | IC2.24 124.78,110.49 C3.1 127.57,113.28 C10.+ 132.33,113.28 133.35,114.3 133.35,123.19 130.81,125.73 43.5,125.73 41.27,123.51 41.27,120.33
BUTTON0
  Top 0.254: IC1.2 55.24,118.43 56.83,120.02 63.82,120.02 65.41,118.43 R1.2
  Bottom 0.254: S1.2 S1.1 83.46,114.66 82.23,115.89 66.04,115.89 65.41,116.52 R1.2
BUTTON1
  Bottom 0.254: S2.2 S2.1 72.67,114.66 72.07,115.25 64.14,115.25 62.87,116.52 R2.2 62.87,118.43 60.33,120.97 50.48,120.97 48.9,119.38 48.9,105.09 49.53,104.46 52.07,104.46 52.7,105.09 IC1.26
BUTTON2
  Bottom 0.254: S3.2 S3.1 61.87,114.97 60.33,116.52 R3.2 60.33,118.43 58.42,120.33 52.7,120.33 51.44,119.06 51.44,110.81 50.16,109.54 IC1.25
BUTTON3
  Top 0.254: R4.2 46.99,102.55 47.62,103.19 IC1.24
  Bottom 0.254: S4.2 S4.1 70.41,19.13 69.22,20.32 R4.2
COL0  (via drill 0.6)
  Top 0.254: LED116.K2 147.01,18.73 LED116.K1 145.41,18.73 v145.41,13.97 | LED115.K2 137.64,28.73 LED115.K1 135.89,28.73 v135.89,24.77 | LED114.K2 128.26,28.73 LED114.K1 126.36,28.73 v126.36,24.77 | LED113.K2 118.89,28.73 LED113.K1 117.16,28.73 v117.16,24.77 | 107.95,28.73 LED112.K1 | LED112.K2 109.51,28.73 107.95,28.73 | LED111.K2 100.14,28.73 LED111.K1 98.42,28.73 v98.42,24.77 | LED110.K2 90.76,28.73 LED110.K1 88.9,28.73 v88.9,24.77 | LED109.K1 | LED109.K2 81.39,28.73 LED109.K1 | 70.48,28.73 LED108.K1 | LED108.K2 72.01,28.73 70.48,28.73 | 60.96,28.73 LED107.K1 | LED107.K2 62.64,28.73 60.96,28.73 | LED106.K2 53.26,28.73 LED106.K1 51.44,28.73 v51.44,24.77 | 42.23,28.73 LED105.K1 | LED105.K2 43.89,28.73 42.23,28.73 | LED104.K2 34.51,28.73 LED104.K1 32.7,28.73 v32.7,24.77 | LED103.K2 25.14,28.73 LED103.K1 23.5,28.73 v23.5,24.77 | LED102.K2 15.76,28.73 LED102.K1 13.97,28.73 v13.97,24.77 | LED101.K2 6.39,18.73 LED101.K1 4.76,18.73 v4.76,14.61 | v42.23,24.77 42.23,28.73 | v60.96,24.77 60.96,28.73 | v70.48,24.77 70.48,28.73 | v79.69,24.77 LED109.K1 | v107.95,24.77 107.95,28.73
  Bottom 0.61: v13.97,24.77 v23.5,24.77 v32.7,24.77 v42.23,24.77 v51.44,24.77 v60.96,24.77 v70.48,24.77 v79.69,24.77 v88.9,24.77 v98.42,24.77 v107.95,24.77 v117.16,24.77 v126.36,24.77 v135.89,24.77 135.89,17.46 139.38,13.97 v145.41,13.97 | v13.97,24.77 13.97,23.5 5.08,14.61 v4.76,14.61 | Q10.1 11.19,24.77 v13.97,24.77
COL0DRV
  Bottom 0.254: IC1.9 R17.1
COL1  (via drill 0.6)
  Top 0.254: 23.5,38.73 LED88.K1 | LED88.K2 25.14,38.73 23.5,38.73 | LED87.K2 15.76,38.73 LED87.K1 13.97,38.73 v13.97,34.61 | LED89.K2 34.51,38.73 LED89.K1 32.7,38.73 v32.7,34.61 | 42.23,38.73 LED90.K1 | LED90.K2 43.89,38.73 42.23,38.73 | LED91.K2 53.26,38.73 LED91.K1 51.44,38.73 v51.44,34.61 | 60.96,38.73 LED92.K1 | LED92.K2 62.64,38.73 60.96,38.73 | 70.48,38.73 LED93.K1 | LED93.K2 72.01,38.73 70.48,38.73 | LED94.K1 | LED94.K2 81.39,38.73 LED94.K1 | LED95.K2 90.76,38.73 LED95.K1 88.9,38.73 v88.9,34.61 | LED96.K2 100.14,38.73 LED96.K1 98.42,38.73 v98.42,34.61 | 107.95,38.73 LED97.K1 | LED97.K2 109.51,38.73 107.95,38.73 | LED98.K2 118.89,38.73 LED98.K1 117.16,38.73 v117.16,34.61 | LED99.K2 128.26,38.73 LED99.K1 126.36,38.73 v126.36,34.61 | LED100.K2 137.64,38.73 LED100.K1 135.89,38.73 v135.89,34.61 | v23.5,34.61 23.5,38.73 | v42.23,34.61 42.23,38.73 | v60.96,34.61 60.96,38.73 | v70.48,34.61 70.48,38.73 | v79.69,34.61 LED94.K1 | v107.95,34.61 107.95,38.73
  Bottom 0.61: v88.9,34.61 v79.69,34.61 v70.48,34.61 v60.96,34.61 v51.44,34.61 v42.23,34.61 v32.7,34.61 v23.5,34.61 v13.97,34.61 11.35,34.61 Q9.1 | v88.9,34.61 92.39,34.61 | v88.9,34.61 v98.42,34.61 v107.95,34.61 v117.16,34.61 v126.36,34.61 v135.89,34.61
COL1DRV
  Bottom 0.305: IC1.10 R16.1
COL2  (via drill 0.6)
  Top 0.254: LED86.K2 137.64,48.73 LED86.K1 135.89,48.73 v135.89,44.77 | LED85.K2 128.26,48.73 LED85.K1 126.36,48.73 v126.36,44.77 | LED84.K2 118.89,48.73 LED84.K1 117.16,48.73 v117.16,44.77 | 107.95,48.73 LED83.K1 | LED83.K2 109.51,48.73 107.95,48.73 | LED82.K2 100.14,48.73 LED82.K1 98.42,48.73 v98.42,44.77 | LED81.K2 90.76,48.73 LED81.K1 88.9,48.73 v88.9,44.77 | LED80.K1 | LED80.K2 81.39,48.73 LED80.K1 | 70.48,48.73 LED79.K1 | LED79.K2 72.01,48.73 70.48,48.73 | LED78.K2 62.64,48.73 LED78.K1 60.96,48.73 v60.96,44.77 | LED77.K2 53.26,48.73 LED77.K1 51.44,48.73 v51.44,44.77 | LED76.K2 43.89,48.73 LED76.K1 42.23,48.73 v42.23,44.77 | LED75.K2 34.51,48.73 LED75.K1 32.7,48.73 v32.7,44.77 | LED74.K2 25.14,48.73 LED74.K1 23.5,48.73 v23.5,44.77 | LED73.K2 15.76,48.73 LED73.K1 13.97,48.73 v13.97,44.77 | v70.48,44.77 70.48,48.73 | v79.69,44.77 LED80.K1 | v107.95,44.77 107.95,48.73
  Bottom 0.61: v135.89,44.77 v126.36,44.77 v117.16,44.77 v107.95,44.77 v98.42,44.77 v88.9,44.77 v79.69,44.77 v70.48,44.77 v60.96,44.77 v51.44,44.77 v42.23,44.77 v32.7,44.77 v23.5,44.77 v13.97,44.77 11.11,44.77 5.96,49.92 Q8.1
COL2DRV
  Bottom 0.305: IC1.11 R15.1
COL3  (via drill 0.6)
  Top 0.254: LED60.K2 25.14,58.73 LED60.K1 23.5,58.73 v23.5,54.93 | LED59.K2 15.76,58.73 LED59.K1 14.06,54.93 v13.97,54.93 | LED61.K2 34.51,58.73 LED61.K1 32.7,58.73 v32.7,54.93 | LED62.K2 43.89,58.73 LED62.K1 42.23,58.73 v42.23,54.93 | LED63.K2 53.26,58.73 LED63.K1 51.44,58.73 v51.44,54.93 | LED64.K2 62.64,58.73 LED64.K1 60.96,58.73 v60.96,54.93 | LED65.K2 72.01,58.73 LED65.K1 70.48,58.73 v70.48,54.93 | LED66.K2 81.39,58.73 LED66.K1 v79.69,54.93 | LED68.K2 100.14,58.73 LED68.K1 98.42,58.73 v98.42,54.93 | LED67.K2 90.76,58.73 LED67.K1 88.9,58.73 v88.9,54.93 | LED69.K2 109.51,58.73 LED69.K1 107.95,58.73 v107.95,54.93 | LED70.K2 118.89,58.73 LED70.K1 117.16,58.73 v117.16,54.93 | LED72.K2 137.64,58.73 LED72.K1 135.89,58.73 v135.89,54.93 | LED71.K2 128.26,58.73 LED71.K1 126.36,58.73 v126.36,54.93
  Bottom 0.61: v135.89,54.93 v126.36,54.93 v117.16,54.93 v107.95,54.93 v98.42,54.93 v88.9,54.93 v79.69,54.93 v70.48,54.93 v60.96,54.93 v51.44,54.93 v42.23,54.93 v32.7,54.93 v23.5,54.93 v13.97,54.93 11.11,54.93 6.04,60 Q7.1
COL3DRV
  Bottom 0.305: IC1.12 R14.1
COL4  (via drill 0.6)
  Top 0.254: LED58.K2 137.64,68.73 LED58.K1 135.89,68.73 v135.89,64.77 | LED57.K2 128.26,68.73 LED57.K1 126.36,68.73 v126.36,64.77 | LED56.K2 118.89,68.73 LED56.K1 117.16,68.73 v117.16,64.77 | LED55.K2 109.51,68.73 LED55.K1 107.95,68.73 v107.95,64.77 | LED54.K2 100.14,68.73 LED54.K1 98.42,68.73 v98.42,64.77 | LED53.K2 90.76,68.73 LED53.K1 88.9,68.73 v88.9,64.77 | LED52.K2 81.39,68.73 LED52.K1 v79.69,64.77 | LED51.K2 72.01,68.73 LED51.K1 70.48,68.73 v70.48,64.77 | LED50.K2 62.64,68.73 LED50.K1 60.96,68.73 v60.96,64.77 | LED49.K2 53.26,68.73 LED49.K1 51.44,68.73 v51.44,64.77 | LED48.K2 43.89,68.73 LED48.K1 42.23,68.73 v42.23,64.77 | LED47.K2 34.51,68.73 LED47.K1 32.7,68.73 v32.7,64.77 | LED46.K2 25.14,68.73 LED46.K1 23.5,68.73 v23.5,64.77 | LED45.K2 15.76,68.73 LED45.K1 13.97,68.73 v13.97,64.77
  Bottom 0.61: v135.89,64.77 v126.36,64.77 v117.16,64.77 v107.95,64.77 v98.42,64.77 v88.9,64.77 v79.69,64.77 v70.48,64.77 v60.96,64.77 v51.44,64.77 v42.23,64.77 v32.7,64.77 v23.5,64.77 v13.97,64.77 11.43,64.77 6.2,70 Q6.1
COL4DRV
  Bottom 0.305: IC1.13 R13.1
COL5  (via drill 0.6)
  Top 0.254: LED32.K2 25.14,78.73 LED32.K1 23.5,78.73 v23.5,74.61 | LED31.K2 15.76,78.73 LED31.K1 14.06,74.61 v13.97,74.61 | LED33.K2 34.51,78.73 LED33.K1 32.7,78.73 v32.7,74.61 | 42.23,78.73 LED34.K1 | LED34.K2 43.89,78.73 42.23,78.73 | LED35.K2 53.26,78.73 LED35.K1 51.44,78.73 v51.44,74.61 | 60.96,78.73 LED36.K1 | LED36.K2 62.64,78.73 60.96,78.73 | 70.48,78.73 LED37.K1 | LED37.K2 72.01,78.73 70.48,78.73 | LED38.K1 | LED38.K2 81.39,78.73 LED38.K1 | LED39.K2 90.76,78.73 LED39.K1 88.9,78.73 v88.9,74.61 | LED40.K2 100.14,78.73 LED40.K1 98.42,78.73 v98.42,74.61 | 107.95,78.73 LED41.K1 | LED41.K2 109.51,78.73 107.95,78.73 | LED42.K2 118.89,78.73 LED42.K1 117.16,78.73 v117.16,74.61 | LED43.K2 128.26,78.73 LED43.K1 126.36,78.73 v126.36,74.61 | LED44.K2 137.64,78.73 LED44.K1 135.89,78.73 v135.89,74.61 | v42.23,74.61 42.23,78.73 | v60.96,74.61 60.96,78.73 | v70.48,74.61 70.48,78.73 | v79.69,74.61 LED38.K1 | v107.95,74.61 107.95,78.73
  Bottom 0.61: v135.89,74.61 v126.36,74.61 v117.16,74.61 v107.95,74.61 v98.42,74.61 v88.9,74.61 v79.69,74.61 v70.48,74.61 v60.96,74.61 v51.44,74.61 v42.23,74.61 v32.7,74.61 v23.5,74.61 v13.97,74.61 10.48,74.61 Q5.1
COL5DRV
  Bottom 0.305: IC1.14 R12.1
COL6  (via drill 0.6)
  Top 0.254: LED30.K2 137.64,88.73 LED30.K1 135.94,84.77 v135.89,84.77 | LED29.K2 128.26,88.73 LED29.K1 126.36,88.73 v126.36,84.77 | LED28.K2 118.89,88.73 LED28.K1 117.16,88.73 v117.16,84.77 | 107.95,88.73 LED27.K1 | LED27.K2 109.51,88.73 107.95,88.73 | LED26.K2 100.14,88.73 LED26.K1 98.42,88.73 v98.42,84.77 | LED25.K2 90.76,88.73 LED25.K1 88.9,88.73 v88.9,84.77 | LED24.K1 | LED24.K2 81.39,88.73 LED24.K1 | 70.48,88.73 LED23.K1 | LED23.K2 72.01,88.73 70.48,88.73 | 60.96,88.73 LED22.K1 | LED22.K2 62.64,88.73 60.96,88.73 | LED21.K2 53.26,88.73 LED21.K1 51.44,88.73 v51.44,84.77 | 42.23,88.73 LED20.K1 | LED20.K2 43.89,88.73 42.23,88.73 | LED19.K2 34.51,88.73 LED19.K1 32.7,88.73 v32.7,84.77 | 23.5,88.73 LED18.K1 | LED18.K2 25.14,88.73 23.5,88.73 | LED17.K2 15.76,88.73 LED17.K1 13.97,88.73 v13.97,84.77 | v107.95,84.77 107.95,88.73 | v79.69,84.77 LED24.K1 | v70.48,84.77 70.48,88.73 | v60.96,84.77 60.96,88.73 | v42.23,84.77 42.23,88.73 | v23.5,84.77 23.5,88.73
  Bottom 0.61: v135.89,84.77 v126.36,84.77 v117.16,84.77 v107.95,84.77 v98.42,84.77 v88.9,84.77 v79.69,84.77 v70.48,84.77 v60.96,84.77 v51.44,84.77 v42.23,84.77 v32.7,84.77 v23.5,84.77 v13.97,84.77 11.11,84.77 5.96,89.93 Q3.1
COL6DRV
  Bottom 0.305: IC1.15 24.77,108.58 21.59,111.76 21.59,113.03 19.68,114.94 R11.1
COL7  (via drill 0.6)
  Top 0.254: LED1.K2 6.39,108.73 LED1.K1 4.69,105.17 5.96,103.9 Q2.1 | LED2.K2 15.76,98.73 LED2.K1 13.97,98.73 v13.97,94.61 | LED3.K2 25.14,98.73 LED3.K1 23.44,94.61 v23.5,94.61 | LED4.K2 34.51,98.73 LED4.K1 32.7,98.73 v32.7,94.61 | LED5.K2 43.89,98.73 LED5.K1 41.91,98.73 v41.91,94.61 | LED6.K2 53.26,98.73 LED6.K1 51.44,98.73 v51.44,94.61 | 60.96,98.73 LED7.K1 | LED7.K2 62.64,98.73 60.96,98.73 | 70.48,98.73 LED8.K1 | LED8.K2 72.01,98.73 70.48,98.73 | LED9.K1 | LED9.K2 81.39,98.73 LED9.K1 | LED10.K2 90.76,98.73 LED10.K1 88.9,98.73 v88.9,94.61 | LED11.K2 100.14,98.73 LED11.K1 98.42,98.73 v98.42,94.61 | 107.95,98.73 LED12.K1 | LED12.K2 109.51,98.73 107.95,98.73 | LED14.K2 128.26,98.73 LED14.K1 126.36,98.73 v126.36,94.61 | LED13.K2 118.89,98.73 LED13.K1 117.16,98.73 v117.16,94.61 | LED15.K2 137.64,98.73 LED15.K1 135.94,94.61 v135.89,94.61 | LED16.K2 147.01,108.73 LED16.K1 145.41,108.73 v145.41,94.61 | v107.95,94.61 107.95,98.73 | v79.69,94.61 LED9.K1 | v70.48,94.61 70.48,98.73 | v60.96,94.61 60.96,98.73
  Bottom 0.61: v145.41,94.61 v135.89,94.61 v126.36,94.61 v117.16,94.61 v107.95,94.61 v98.42,94.61 v88.9,94.61 v79.69,94.61 v70.48,94.61 v60.96,94.61 v51.44,94.61 v41.91,94.61 v32.7,94.61 v23.5,94.61 v13.97,94.61 11.34,94.61 Q2.1
COL7DRV
  Bottom 0.305: IC1.16 27.3,108.58 22.23,113.67 R10.1
DISP_CLK
  Top 0.254: IC1.4 50.16,120.97 53.34,124.14 114.3,124.14 117.47,120.97 IC2.3
DISP_DAT
  Top 0.254: IC2.2 120.02,120.97 115.89,125.09 51.75,125.09 47.94,121.28 47.94,118.75 45.09,115.89 IC1.6
DISP_LAT
  Top 0.254: IC2.4 114.94,120.97 112.71,123.19 54.93,123.19 52.7,120.97 IC1.3
DISP_OE
  Top 0.254: IC2.21 114.94,113.67 113.67,114.94 113.67,120.97 112.39,122.24 55.24,122.24 53.98,120.97 53.98,113.03 53.34,112.39 47.94,112.39 47.62,112.71 IC1.5
GND  (via drill 0.5)
  Top 0.305: v120.02,10.79 115.57,10.79 114.94,10.16 114.94,8.89 114.3,8.26 111.76,8.26 111.12,8.89 C6.2 111.12,10.16 110.49,10.79 v104.14,10.79 v104.14,15.88 110.49,15.88 111.12,16.51 C7.2 111.12,17.78 111.76,18.41 114.3,18.41 114.94,17.78 114.94,16.51 115.57,15.88 v120.02,15.88 v120.02,10.79 | v120.02,10.79 120.02,7.62 119.38,6.99 IC3.4
  Bottom 0.305: v120.02,10.79 115.57,10.79 114.94,10.16 114.94,8.89 114.3,8.26 111.76,8.26 111.12,8.89 111.12,10.16 110.49,10.79 v104.14,10.79 v104.14,15.88 110.49,15.88 111.12,16.51 111.12,17.78 111.76,18.41 114.3,18.41 114.94,17.78 114.94,16.51 115.57,15.88 v120.02,15.88 v120.02,10.79 | v120.02,10.79 120.02,7.62 119.38,6.99 IC3.4
  pour Bottom: -0.64,-0.64 -0.64,130.18 150.5,130.18 150.5,-0.64
  pour Top: -0.64,-0.64 -0.64,130.18 150.5,130.18 150.5,-0.64
LIGHT_SENSOR
  Bottom 0.254: Q4.K 76.27,118.5 75.25,117.47 R5.2 67.94,118.75 65.09,121.6 48.9,121.6 46.35,119.06 46.35,110.81 45.09,109.54 IC1.23
MISO
  Top 0.305: IC1.18 32.38,108.58 31.11,109.86 21.59,109.86 JP1.1
MOSI
  Top 0.305: IC1.17 29.84,105.41 29.21,104.78 20.32,104.78 18.41,106.68 18.41,109.22 JP1.4
N$1
  Bottom 0.406: IC3.1 Q1.2 113.67,15.88 C7.1
N$2
  Bottom 0.406: IC3.2 Q1.1 113.67,10.79 C6.1
N$3
  Bottom 0.406: R8.2 107.95,6.99 109.22,5.71 109.22,3.17 110.49,1.91 D1.C
N$4
  Bottom 0.406: BATT1.+2 83.57,10.54 85.72,12.7 94.61,12.7 96.77,10.54 BATT1.+1 96.77,4.19 99.06,1.91 D1.A
N$5  (via drill 0.5)
  Top 0.254: R10.2 22.23,128.27 21.59,128.91 14.61,128.91 10.16,124.46 10.16,121.92 8.26,120.02 8.26,107.95 6.35,106.05 v6.35,104.78
  Bottom 0.254: Q2.2 4.69,103.11 v6.35,104.78
N$6
  Bottom 0.406: IC3.3 116.84,9.53 R8.1 C5.1
N$7
  Top 0.254: R11.2 14.61,127.64 10.79,123.83 10.79,121.28 8.89,119.38 8.89,107.31 7.3,105.73 7.3,98.11 4.69,95.49 Q3.2
N$8
  Top 0.254: R12.2 24.77,126.36 24.13,125.73 13.97,125.73 11.43,123.19 11.43,120.65 9.53,118.75 9.53,106.68 7.94,105.09 7.94,97.47 7.62,97.16 7.62,88.27 4.45,85.09 Q5.2
N$9
  Top 0.254: R13.2 27.3,126.36 26.04,125.09 14.61,125.09 12.06,122.56 12.06,120.02 10.16,118.11 10.16,106.05 8.57,104.46 8.57,96.84 8.26,96.52 8.26,87.63 7.62,87 7.62,78.11 4.69,75.17 Q6.2
N$10
  Top 0.254: R14.2 29.84,126.36 27.94,124.46 15.24,124.46 12.7,121.92 12.7,119.38 10.79,117.47 10.79,105.41 9.21,103.82 9.21,96.2 8.89,95.89 8.89,87 8.26,86.36 8.26,77.47 7.62,76.83 7.62,68.58 4.69,65.65 Q7.2
N$11
  Top 0.254: R15.2 32.38,126.36 29.84,123.83 15.88,123.83 13.34,121.28 13.34,118.75 11.43,116.84 11.43,104.78 9.84,103.19 9.84,95.57 9.53,95.25 9.53,86.36 8.89,85.72 8.89,76.83 8.26,76.2 8.26,67.94 7.62,67.31 7.62,58.42 4.69,55.49 Q8.2
N$12
  Top 0.254: R16.2 34.92,126.36 31.75,123.19 16.51,123.19 13.97,120.65 13.97,118.11 12.06,116.2 12.06,104.14 10.48,102.55 10.48,94.93 10.16,94.61 10.16,85.72 9.53,85.09 9.53,76.2 8.89,75.56 8.89,67.31 8.26,66.67 8.26,57.78 7.62,57.15 7.62,48.9 4.69,45.96 Q9.2
N$13
  Top 0.254: R17.2 37.47,126.36 33.66,122.56 17.14,122.56 14.61,120.02 14.61,117.47 12.7,115.57 12.7,103.5 11.11,101.92 11.11,94.3 10.79,93.98 10.79,85.09 10.16,84.45 10.16,75.56 9.53,74.93 9.53,66.67 8.89,66.04 8.89,57.15 8.26,56.52 8.26,48.26 7.62,47.62 7.62,38.73 4.69,35.8 Q10.2
N$14
  Bottom 0.254: IC1.21 40.01,108.58 43.81,112.39 43.81,116.2 C9.1
N$15
  Top 0.254: R18.1 IC2.23
RESET
  Top 0.305: JP1.5 20.95,111.76 56.52,111.76 57.78,113.03 IC1.1
  Bottom 0.305: IC1.1 R9.1
ROW0  (via drill 0.5)
  Top 0.254: LED1.A1 2.99,111.27 LED1.A2 2.99,102.05 1.27,100.33 1.27,82.87 | LED101.A1 2.99,21.27 LED101.A2 1.59,20 1.27,20.32 1.27,82.87 | IC2.5 112.39,114.94 111.12,113.67 111.12,108.58 103.5,100.97 103.5,78.42 v100.97,75.88 | 1.27,82.87 v2.54,82.87
  Bottom 0.254: v100.97,75.88 11.75,75.88 9.84,77.79 9.84,81.28 8.26,82.87 v2.54,82.87
ROW1  (via drill 0.5)
  Top 0.254: LED2.A1 12.36,101.27 LED2.A2 LED17.A2 | LED17.A1 12.36,91.27 LED17.A2 | 12.36,81.27 LED31.A1 | 12.36,81.27 LED31.A2 12.36,77.13 | LED45.A1 12.36,71.27 LED45.A2 10.17,70 10.16,70.01 | LED59.A1 12.36,61.27 LED59.A2 10.17,60 10.16,60.01 | LED73.A1 12.36,51.27 LED73.A2 10.17,50 10.16,50.01 | LED87.A1 12.36,41.27 LED87.A2 10.16,40 10.16,40.01 | LED102.A1 12.36,31.27 LED102.A2 10.96,30 10.16,30.8 10.16,40.01 | 10.16,40.01 10.16,50.01 | 10.16,50.01 10.16,60.01 | 10.16,60.01 10.16,70.01 | 10.16,70.01 10.16,74.3 12.36,76.5 12.36,77.13 | 12.36,81.27 LED17.A2 | IC2.6 109.86,114.94 108.58,113.67 108.58,107 102.87,101.28 102.87,80.33 v100.01,77.47 | 12.36,77.13 v12.38,77.15
  Bottom 0.254: v100.01,77.47 12.7,77.47 v12.38,77.15 12.36,77.13
ROW2  (via drill 0.5)
  Top 0.254: LED3.A1 21.74,101.27 LED3.A2 20.62,100 19.68,99.06 19.68,90 | LED18.A1 21.74,91.27 LED18.A2 19.68,90 | LED32.A1 21.74,81.27 LED32.A2 19.68,80 | LED46.A1 21.74,71.27 LED46.A2 19.68,70 | LED60.A1 21.74,61.27 LED60.A2 19.68,60 | LED88.A1 21.74,41.27 LED88.A2 19.68,40 | LED103.A1 21.74,31.27 LED103.A2 20.48,30 19.68,30.8 19.68,40 | 19.68,80 v19.68,82.55 19.68,90 | 19.68,70 19.68,80 | 19.68,60 19.68,70 | 19.68,40 19.68,50 | 19.68,50 LED74.A2 21.74,51.27 LED74.A1 | 19.68,50 19.68,60 | IC2.7 107.31,114.94 106.05,113.67 106.05,105.41 102.23,101.6 102.23,83.5 v101.28,82.55
  Bottom 0.254: v19.68,82.55 v101.28,82.55
ROW3  (via drill 0.5)
  Top 0.254: LED4.A1 31.11,101.27 LED4.A2 30.15,100 29.21,99.06 29.21,90 | LED19.A1 31.11,91.27 LED19.A2 29.21,90 | LED33.A1 31.11,81.27 LED33.A2 29.21,80 | LED47.A1 31.11,71.27 LED47.A2 29.21,70 | LED61.A1 31.11,61.27 LED61.A2 29.21,60 | LED89.A1 31.11,41.27 LED89.A2 29.21,40 | LED104.A1 31.11,31.27 LED104.A2 30.01,30 29.21,30.8 29.21,40 | 29.21,80 v29.21,83.5 29.21,90 | 29.21,70 29.21,80 | 29.21,60 29.21,70 | 29.21,40 29.21,50 | 29.21,50 LED75.A2 31.11,51.27 LED75.A1 | 29.21,50 29.21,60 | IC2.8 104.78,114.94 103.5,113.67 103.5,103.82 101.6,101.92 101.6,84.77 v100.33,83.5
  Bottom 0.254: v29.21,83.5 v100.33,83.5
ROW4  (via drill 0.5)
  Top 0.254: LED5.A1 40.49,101.27 LED5.A2 39.36,100 38.42,99.06 38.42,90 | LED20.A1 40.49,91.27 LED20.A2 38.42,90 | LED34.A1 40.49,81.27 LED34.A2 38.42,80 | LED48.A1 40.49,71.27 LED48.A2 38.42,70 | LED62.A1 40.49,61.27 LED62.A2 38.42,60 | LED90.A1 40.49,41.27 LED90.A2 38.42,40 | LED105.A1 40.49,31.27 LED105.A2 39.22,30 38.42,30.8 38.42,40 | 38.42,80 v38.42,86.36 38.42,90 | 38.42,70 38.42,80 | 38.42,60 38.42,70 | 38.42,40 38.42,50 | 38.42,50 LED76.A2 40.49,51.27 LED76.A1 | 38.42,50 38.42,60 | IC2.9 102.23,114.94 100.97,113.67 100.97,107.95 93.98,100.97 93.98,88.58 v91.76,86.36
  Bottom 0.254: v38.42,86.36 v91.76,86.36
ROW5  (via drill 0.5)
  Top 0.254: LED6.A1 49.86,101.27 LED6.A2 48.88,100 47.94,99.06 47.94,90 | LED21.A1 49.86,91.27 LED21.A2 47.94,90 | LED35.A1 49.86,81.27 LED35.A2 47.94,80 | LED49.A1 49.86,71.27 LED49.A2 47.94,70 | LED63.A1 49.86,61.27 LED63.A2 47.94,60 | LED77.A1 49.86,51.27 LED77.A2 47.94,50 | LED91.A1 49.86,41.27 LED91.A2 47.94,40 | LED106.A1 49.86,31.27 LED106.A2 48.74,30 47.94,30.8 47.94,40 | 47.94,80 v47.94,87.31 47.94,90 | 47.94,70 47.94,80 | 47.94,60 47.94,70 | 47.94,50 47.94,60 | 47.94,40 47.94,50 | IC2.10 99.69,114.94 98.42,113.67 98.42,106.36 93.34,101.28 93.34,89.85 v90.81,87.31
  Bottom 0.254: v47.94,87.31 v90.81,87.31
ROW6  (via drill 0.5)
  Top 0.254: LED7.A1 59.24,101.27 LED7.A2 58.09,100 57.15,99.06 v57.15,92.39 57.15,90 | LED22.A1 59.24,91.27 LED22.A2 57.15,90 | LED36.A1 59.24,81.27 LED36.A2 57.15,80 | LED50.A1 59.24,71.27 LED50.A2 57.15,70 | LED64.A1 59.24,61.27 LED64.A2 57.15,60 | LED78.A1 59.24,51.27 LED78.A2 57.15,50 | LED92.A1 59.24,41.27 LED92.A2 57.15,40 | LED107.A1 59.24,31.27 LED107.A2 57.95,30 57.15,30.8 57.15,40 | 57.15,80 57.15,90 | 57.15,70 57.15,80 | 57.15,60 57.15,70 | 57.15,50 57.15,60 | 57.15,40 57.15,50 | IC2.11 97.16,114.94 95.89,113.67 95.89,104.78 92.71,101.6 92.71,93.34 v91.76,92.39
  Bottom 0.254: v57.15,92.39 v91.76,92.39
ROW7  (via drill 0.5)
  Top 0.254: LED8.A1 68.61,101.27 LED8.A2 67.61,100 66.67,99.06 v66.67,93.34 66.67,90 | LED37.A1 68.61,81.27 LED37.A2 66.67,80 | LED51.A1 68.61,71.27 LED51.A2 66.67,70 | LED65.A1 68.61,61.27 LED65.A2 66.67,60 | LED79.A1 68.61,51.27 LED79.A2 66.67,50 | LED93.A1 68.61,41.27 LED93.A2 66.67,40 | LED108.A1 68.61,31.27 LED108.A2 67.47,30 66.67,30.8 66.67,40 | 66.67,80 66.67,90 | 66.67,90 LED23.A2 68.61,91.27 LED23.A1 | 66.67,70 66.67,80 | 66.67,60 66.67,70 | 66.67,50 66.67,60 | 66.67,40 66.67,50 | IC2.12 94.61,114.94 93.34,113.67 93.34,103.19 92.08,101.92 92.08,94.61 v90.81,93.34
  Bottom 0.254: v66.67,93.34 v90.81,93.34
ROW8
  Top 0.254: LED9.A1 77.99,101.27 LED9.A2 76.82,100 75.88,99.06 75.88,90 | LED24.A1 77.99,91.27 LED24.A2 75.88,90 | LED38.A1 77.99,81.27 LED38.A2 75.88,80 | LED52.A1 77.99,71.27 LED52.A2 75.88,70 | LED66.A1 77.99,61.27 LED66.A2 75.88,60 | LED80.A1 77.99,51.27 LED80.A2 75.88,50 | LED94.A1 77.99,41.27 LED94.A2 75.88,40 | LED109.A1 77.99,31.27 LED109.A2 76.68,30 75.88,30.8 75.88,40 | 75.88,60 75.88,70 | 75.88,80 75.88,90 | 75.88,70 75.88,80 | 75.88,50 75.88,60 | 75.88,40 75.88,50
  Bottom 0.254: IC2.13 94.61,107 90.17,102.55 80.97,102.55 LED9.A1
ROW9
  Top 0.254: LED10.A1 87.36,101.27 LED10.A2 86.35,100 85.41,99.06 85.41,90 | LED39.A1 87.36,81.27 LED39.A2 85.41,80 | LED53.A1 87.36,71.27 LED53.A2 85.41,70 | LED67.A1 87.36,61.27 LED67.A2 85.41,60 | LED95.A1 87.36,41.27 LED95.A2 85.41,40 | LED110.A1 87.36,31.27 LED110.A2 86.2,30 85.41,30.8 85.41,40 | 85.41,80 85.41,90 | 85.41,70 85.41,80 | 85.41,60 85.41,70 | 85.41,40 85.41,50 | 85.41,50 LED81.A2 87.36,51.27 LED81.A1 | 85.41,50 85.41,60 | 85.41,90 LED25.A2 87.36,91.27 LED25.A1
  Bottom 0.254: LED10.A1 89.2,101.27 89.22,101.28 91.44,101.28 97.16,107 IC2.14
ROWA
  Top 0.254: LED11.A1 96.74,101.27 LED11.A2 95.56,100 94.61,99.06 94.61,90 | LED26.A1 96.74,91.27 LED26.A2 94.61,90 | LED40.A1 96.74,81.27 LED40.A2 94.61,80 | LED54.A1 96.74,71.27 LED54.A2 94.61,70 | LED68.A1 96.74,61.27 LED68.A2 94.61,60 | LED82.A1 96.74,51.27 LED82.A2 94.61,50 | LED96.A1 96.74,41.27 LED96.A2 94.61,40 | LED111.A1 96.74,31.27 LED111.A2 95.41,30 94.61,30.8 94.61,40 | 94.61,80 94.61,90 | 94.61,70 94.61,80 | 94.61,60 94.61,70 | 94.61,50 94.61,60 | 94.61,40 94.61,50
  Bottom 0.254: LED11.A1 98.44,101.3 99.69,102.55 IC2.15
ROWB
  Top 0.254: LED12.A1 106.11,101.27 LED12.A2 105.08,100 104.14,99.06 104.14,90 | LED27.A1 106.11,91.27 LED27.A2 104.14,90 | LED41.A1 106.11,81.27 LED41.A2 104.14,80 | LED55.A1 106.11,71.27 LED55.A2 104.14,70 | LED69.A1 106.11,61.27 LED69.A2 104.14,60 | LED83.A1 106.11,51.27 LED83.A2 104.14,50 | LED112.A1 106.11,31.27 LED112.A2 104.94,30 104.14,30.8 104.14,31.27 104.14,40 | 104.14,80 104.14,90 | 104.14,70 104.14,80 | 104.14,60 104.14,70 | 104.14,50 104.14,60 | 104.14,40 LED97.A2 106.11,41.27 LED97.A1 | 104.14,40 104.14,50
  Bottom 0.254: IC2.16 102.23,106.85 LED12.A1
ROWC
  Top 0.254: LED13.A1 115.49,101.27 LED13.A2 114.29,100 113.35,99.06 113.35,90 | LED28.A1 115.49,91.27 LED28.A2 113.35,90 | LED42.A1 115.49,81.27 LED42.A2 113.35,80 | LED56.A1 115.49,71.27 LED56.A2 113.35,70 | LED70.A1 115.49,61.27 LED70.A2 113.35,60 | LED84.A1 115.49,51.27 LED84.A2 113.35,50 | LED98.A1 115.49,41.27 LED98.A2 113.35,40 | LED113.A1 115.49,31.27 LED113.A2 114.14,30 113.35,30.8 113.35,40 | 113.35,80 113.35,90 | 113.35,70 113.35,80 | 113.35,60 113.35,70 | 113.35,50 113.35,60 | 113.35,40 113.35,50
  Bottom 0.254: IC2.17 104.78,107 110.49,101.28 117.17,101.28 LED13.A1
ROWD
  Top 0.254: LED14.A1 124.86,101.27 LED14.A2 123.5,100 122.56,99.06 122.56,90 | LED29.A1 124.86,91.27 LED29.A2 122.56,90 | LED43.A1 124.86,81.27 LED43.A2 122.56,80 | LED57.A1 124.86,71.27 LED57.A2 122.56,70 | LED71.A1 124.86,61.27 LED71.A2 122.56,60 | LED85.A1 124.86,51.27 LED85.A2 122.56,50 | LED99.A1 124.86,41.27 LED99.A2 122.56,40 | LED114.A1 124.86,31.27 LED114.A2 123.51,30 122.56,30.95 122.56,40 | 122.56,80 122.56,90 | 122.56,70 122.56,80 | 122.56,60 122.56,70 | 122.56,50 122.56,60 | 122.56,40 122.56,50
  Bottom 0.254: IC2.18 107.31,107 111.76,102.55 125.28,102.55 LED14.A1
ROWE
  Top 0.254: LED15.A1 134.24,101.27 LED15.A2 133.02,100 132.08,99.06 132.08,90 | LED30.A1 134.24,91.27 LED30.A2 132.08,90 | LED44.A1 134.24,81.27 LED44.A2 132.08,80 | LED58.A1 134.24,71.27 LED58.A2 132.08,70 | LED72.A1 134.24,61.27 LED72.A2 132.08,60 | LED86.A1 134.24,51.27 LED86.A2 132.08,50 | LED115.A1 134.24,31.27 LED115.A2 133.03,30 132.08,30.95 132.08,40 | 132.08,50 132.08,60 | 132.08,80 132.08,90 | 132.08,70 132.08,80 | 132.08,60 132.08,70 | 132.08,40 LED100.A2 134.24,41.27 LED100.A1 | 132.08,40 132.08,50
  Bottom 0.254: IC2.19 109.86,107 113.03,103.82 133.38,103.82 LED15.A1
ROWF  (via drill 0.5)
  Top 0.254: LED16.A1 143.61,111.27 LED16.A2 142.38,110 141.6,109.22 v141.6,105.09 141.6,20.95 142.56,20 LED116.A2 143.61,21.27 LED116.A1
  Bottom 0.254: IC2.20 112.39,107 114.3,105.09 v141.6,105.09
SCK
  Top 0.305: JP1.3 33.02,110.49 34.92,108.58 IC1.19
SCL  (via drill 0.5)
  Top 0.254: v123.19,22.86 122.24,23.81 56.83,23.81 56.2,24.45 56.2,103.5 57.78,105.09 IC1.28
  Bottom 0.254: IC3.6 124.46,9.53 123.19,10.79 v123.19,22.86
  Bottom 0.406: IC3.6 128.91,9.53 R7.1
SDA  (via drill 0.5)
  Top 0.254: IC1.27 55.24,24.45 56.83,22.86 v121.92,22.86
  Bottom 0.254: v121.92,22.86 121.92,9.21 124.14,6.99 IC3.5
  Bottom 0.406: IC3.5 128.27,6.99 R6.1

### Text on the board
tNames: Word Clock 2.0